# EAGLE design P20 Control Board V1 (EAGLE 9.5.0)

## Sheet 1 of 4
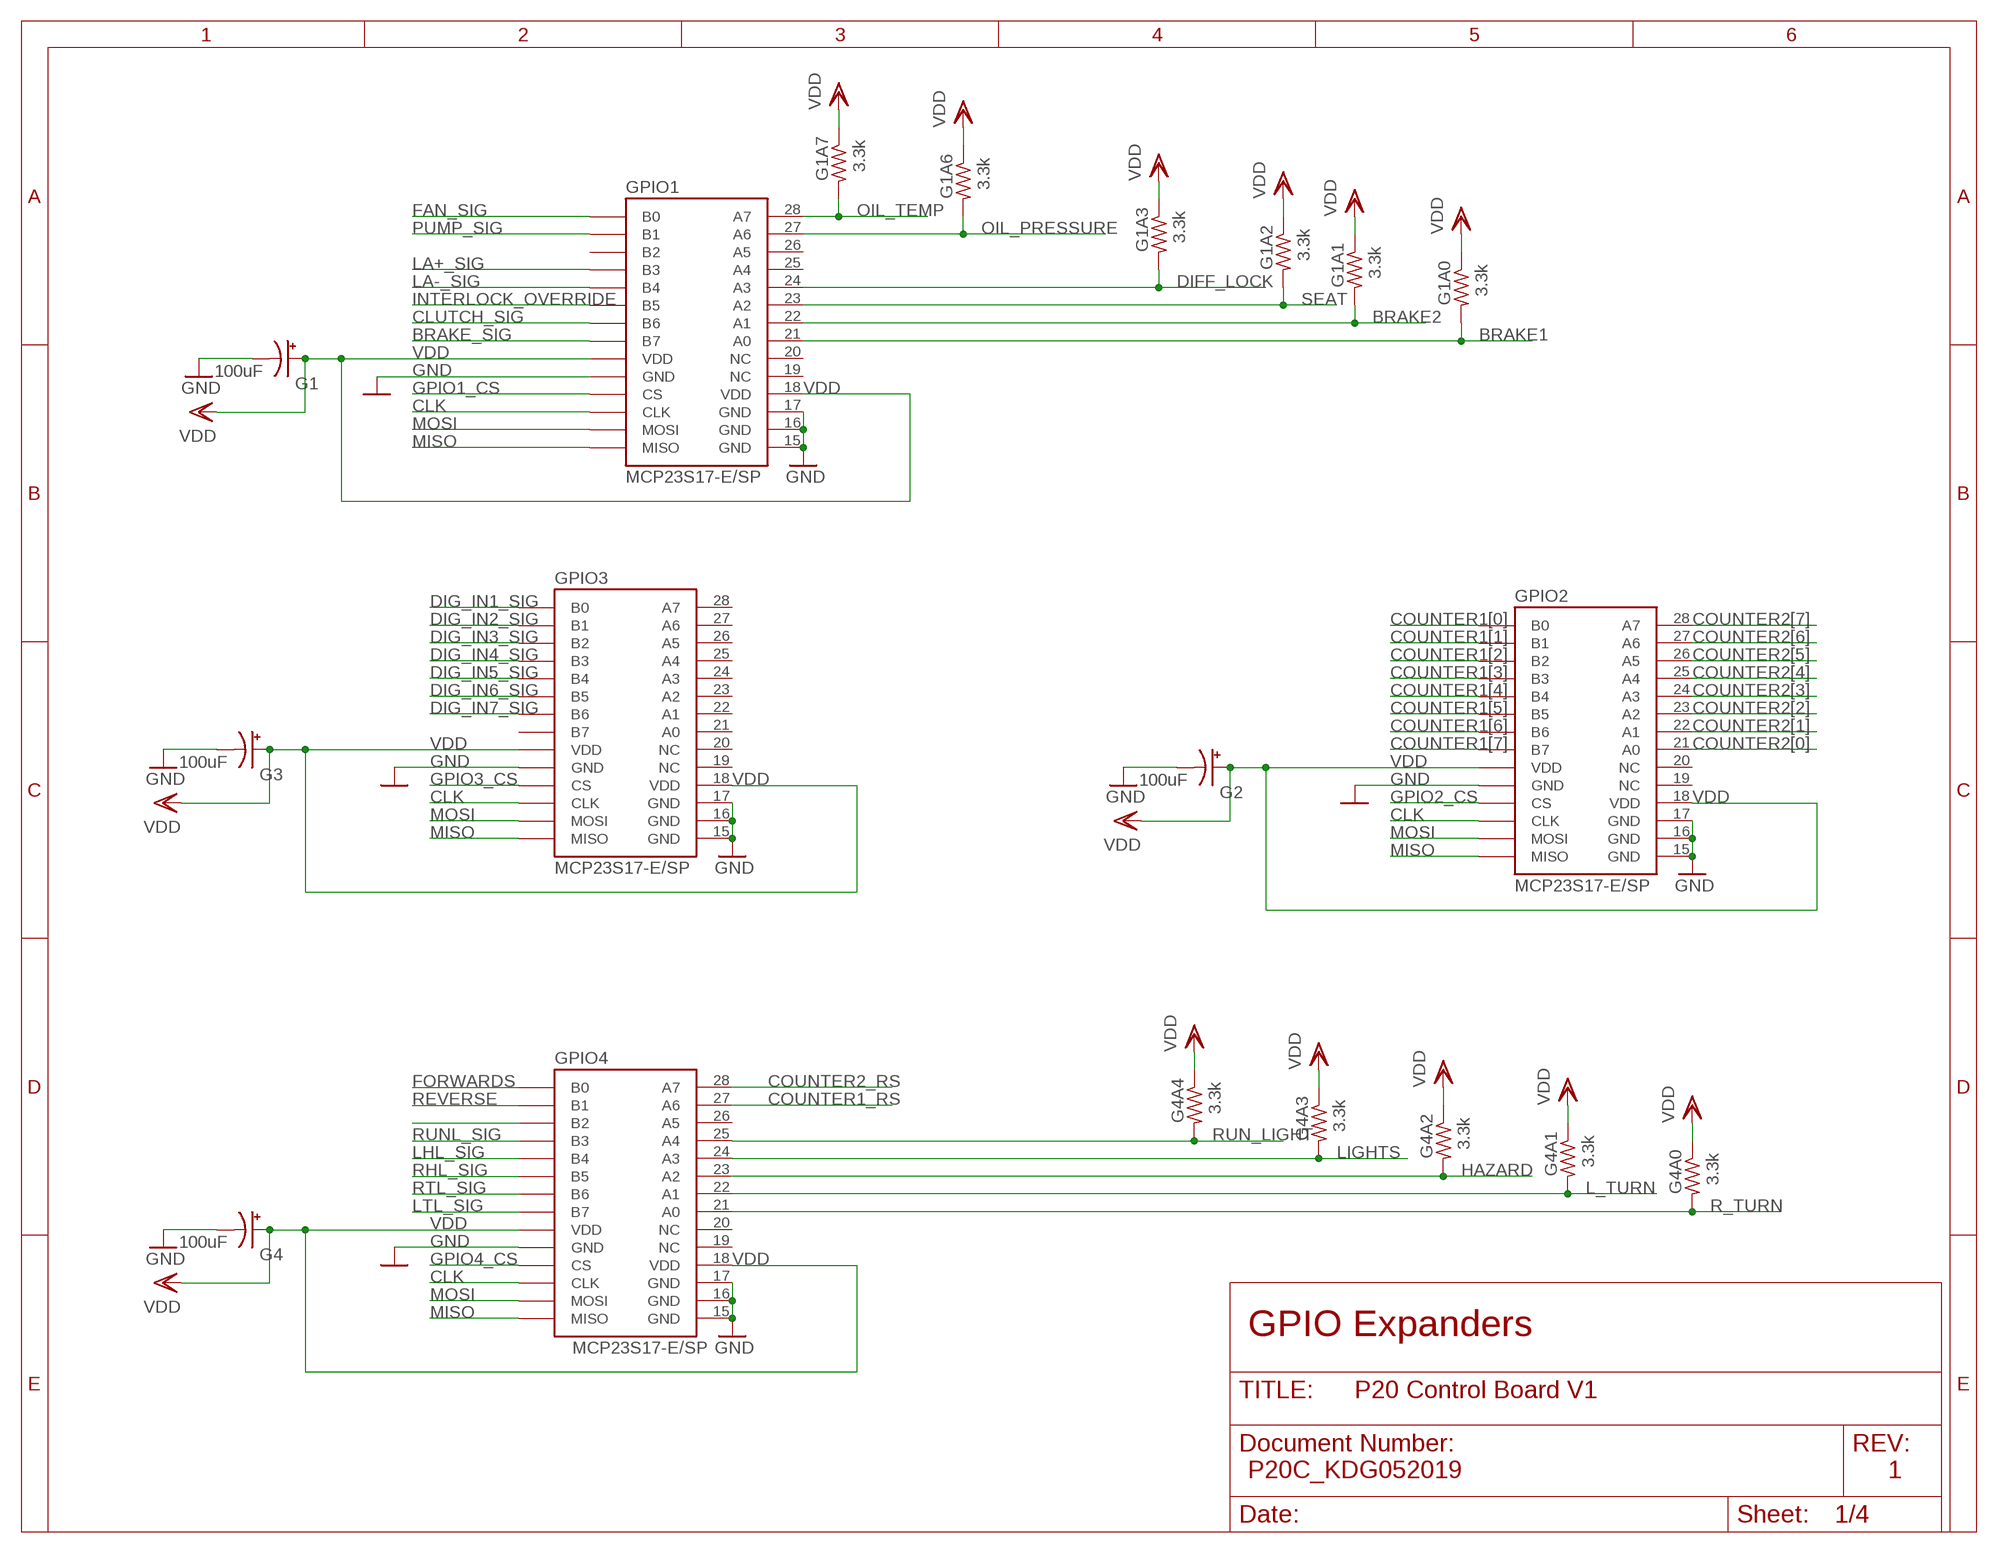
[diagram p0: schematic, sheet 1]

### Parts
G1  100uF  CPOL-USTAP5-80  [TAP5-80]
G1A0  3.3k  R-US_0207/10  [0207/10]
G1A1  3.3k  R-US_0207/10  [0207/10]
G1A2  3.3k  R-US_0207/10  [0207/10]
G1A3  3.3k  R-US_0207/10  [0207/10]
G1A6  3.3k  R-US_0207/10  [0207/10]
G1A7  3.3k  R-US_0207/10  [0207/10]
G2  100uF  CPOL-USTAP5-80  [TAP5-80]
G3  100uF  CPOL-USTAP5-80  [TAP5-80]
G4  100uF  CPOL-USTAP5-80  [TAP5-80]
G4A0  3.3k  R-US_0207/10  [0207/10]
G4A1  3.3k  R-US_0207/10  [0207/10]
G4A2  3.3k  R-US_0207/10  [0207/10]
G4A3  3.3k  R-US_0207/10  [0207/10]
G4A4  3.3k  R-US_0207/10  [0207/10]
GPIO1  MCP23S17-E/SP  [GPIO_XPDR]
GPIO2  MCP23S17-E/SP  [GPIO_XPDR]
GPIO3  MCP23S17-E/SP  [GPIO_XPDR]
GPIO4  MCP23S17-E/SP  [GPIO_XPDR]

### Nets
BRAKE1 [signals]: G1A0.2 GPIO1.21(A0) ; also sheet 2,4
BRAKE2 [signals]: G1A1.2 GPIO1.22(A1) ; also sheet 2,4
BRAKE_SIG [signals]: GPIO1.8(B7) ; also sheet 3
CLK [signals]: GPIO1.12(CLK) GPIO2.12(CLK) GPIO3.12(CLK) GPIO4.12(CLK) ; also sheet 2,4
CLUTCH_SIG [signals]: GPIO1.7(B6) ; also sheet 3
COUNTER1[0] [signals]: GPIO2.1(B0) ; also sheet 4
COUNTER1[1] [signals]: GPIO2.2(B1) ; also sheet 4
COUNTER1[2] [signals]: GPIO2.3(B2) ; also sheet 4
COUNTER1[3] [signals]: GPIO2.4(B3) ; also sheet 4
COUNTER1[4] [signals]: GPIO2.5(B4) ; also sheet 4
COUNTER1[5] [signals]: GPIO2.6(B5) ; also sheet 4
COUNTER1[6] [signals]: GPIO2.7(B6) ; also sheet 4
COUNTER1[7] [signals]: GPIO2.8(B7) ; also sheet 4
COUNTER1_RS [signals]: GPIO4.27(A6) ; also sheet 4
COUNTER2[0] [signals]: GPIO2.21(A0) ; also sheet 4
COUNTER2[1] [signals]: GPIO2.22(A1) ; also sheet 4
COUNTER2[2] [signals]: GPIO2.23(A2) ; also sheet 4
COUNTER2[3] [signals]: GPIO2.24(A3) ; also sheet 4
COUNTER2[4] [signals]: GPIO2.25(A4) ; also sheet 4
COUNTER2[5] [signals]: GPIO2.26(A5) ; also sheet 4
COUNTER2[6] [signals]: GPIO2.27(A6) ; also sheet 4
COUNTER2[7] [signals]: GPIO2.28(A7) ; also sheet 4
COUNTER2_RS [signals]: GPIO4.28(A7) ; also sheet 4
DIFF_LOCK [signals]: G1A3.2 GPIO1.24(A3) ; also sheet 2
DIG_IN1_SIG [signals]: GPIO3.1(B0) ; also sheet 3
DIG_IN2_SIG [signals]: GPIO3.2(B1) ; also sheet 3
DIG_IN3_SIG [signals]: GPIO3.3(B2) ; also sheet 3
DIG_IN4_SIG [signals]: GPIO3.4(B3) ; also sheet 3
DIG_IN5_SIG [signals]: GPIO3.5(B4) ; also sheet 3
DIG_IN6_SIG [signals]: GPIO3.6(B5) ; also sheet 3
DIG_IN7_SIG [signals]: GPIO3.7(B6) ; also sheet 3
FAN_SIG [signals]: GPIO1.1(B0) ; also sheet 3
FORWARDS [signals]: GPIO4.1(B0)
GND [ground]: G1.- G2.- G3.- G4.- GPIO1.10(GND) GPIO1.15(GND) GPIO1.16(GND) GPIO1.17(GND) GPIO2.10(GND) GPIO2.15(GND) GPIO2.16(GND) GPIO2.17(GND) GPIO3.10(GND) GPIO3.15(GND) GPIO3.16(GND) GPIO3.17(GND) GPIO4.10(GND) GPIO4.15(GND) GPIO4.16(GND) GPIO4.17(GND) ; also sheet 2,3,4
GPIO1_CS [signals]: GPIO1.11(CS) ; also sheet 2
GPIO2_CS [signals]: GPIO2.11(CS) ; also sheet 2
GPIO3_CS [signals]: GPIO3.11(CS) ; also sheet 2
GPIO4_CS [signals]: GPIO4.11(CS) ; also sheet 2
HAZARD [signals]: G4A2.2 GPIO4.23(A2) ; also sheet 2
INTERLOCK_OVERRIDE [signals]: GPIO1.6(B5) ; also sheet 4
L_TURN [signals]: G4A1.2 GPIO4.22(A1) ; also sheet 2
LA+_SIG [signals]: GPIO1.4(B3) ; also sheet 3
LA-_SIG [signals]: GPIO1.5(B4) ; also sheet 3
LHL_SIG [signals]: GPIO4.5(B4) ; also sheet 3
LIGHTS [signals]: G4A3.2 GPIO4.24(A3) ; also sheet 2
LTL_SIG [signals]: GPIO4.8(B7) ; also sheet 3
MISO [signals]: GPIO1.14(MISO) GPIO2.14(MISO) GPIO3.14(MISO) GPIO4.14(MISO) ; also sheet 2,4
MOSI [signals]: GPIO1.13(MOSI) GPIO2.13(MOSI) GPIO3.13(MOSI) GPIO4.13(MOSI) ; also sheet 2,4
N$25: GPIO4.3(B2)
OIL_PRESSURE [signals]: G1A6.2 GPIO1.27(A6) ; also sheet 2
OIL_TEMP [signals]: G1A7.2 GPIO1.28(A7) ; also sheet 2,4
PUMP_SIG [signals]: GPIO1.2(B1) ; also sheet 3
R_TURN [signals]: G4A0.2 GPIO4.21(A0) ; also sheet 2
REVERSE [signals]: GPIO4.2(B1)
RHL_SIG [signals]: GPIO4.6(B5) ; also sheet 3
RTL_SIG [signals]: GPIO4.7(B6) ; also sheet 3
RUN_LIGHT [signals]: G4A4.2 GPIO4.25(A4) ; also sheet 2
RUNL_SIG [signals]: GPIO4.4(B3) ; also sheet 3
SEAT [signals]: G1A2.2 GPIO1.23(A2) ; also sheet 2,4
VDD [VDD]: G1.+ G1A0.1 G1A1.1 G1A2.1 G1A3.1 G1A6.1 G1A7.1 G2.+ G3.+ G4.+ G4A0.1 G4A1.1 G4A2.1 G4A3.1 G4A4.1 GPIO1.9(VDD) GPIO1.18(VDD) GPIO2.9(VDD) GPIO2.18(VDD) GPIO3.9(VDD) GPIO3.18(VDD) GPIO4.9(VDD) GPIO4.18(VDD) ; also sheet 2,4
Unconnected: GPIO1.3(B2) GPIO1.19(NC) GPIO1.20(NC) GPIO1.25(A4) GPIO1.26(A5) GPIO2.19(NC) GPIO2.20(NC) GPIO3.8(B7) GPIO3.19(NC) GPIO3.20(NC) GPIO3.21(A0) GPIO3.22(A1) GPIO3.23(A2) GPIO3.24(A3) GPIO3.25(A4) GPIO3.26(A5) GPIO3.27(A6) GPIO3.28(A7) GPIO4.19(NC) GPIO4.20(NC) GPIO4.26(A5)

### Notes on the sheet
- GPIO Expanders
- P20C_KDG052019 | 1

## Sheet 2 of 4
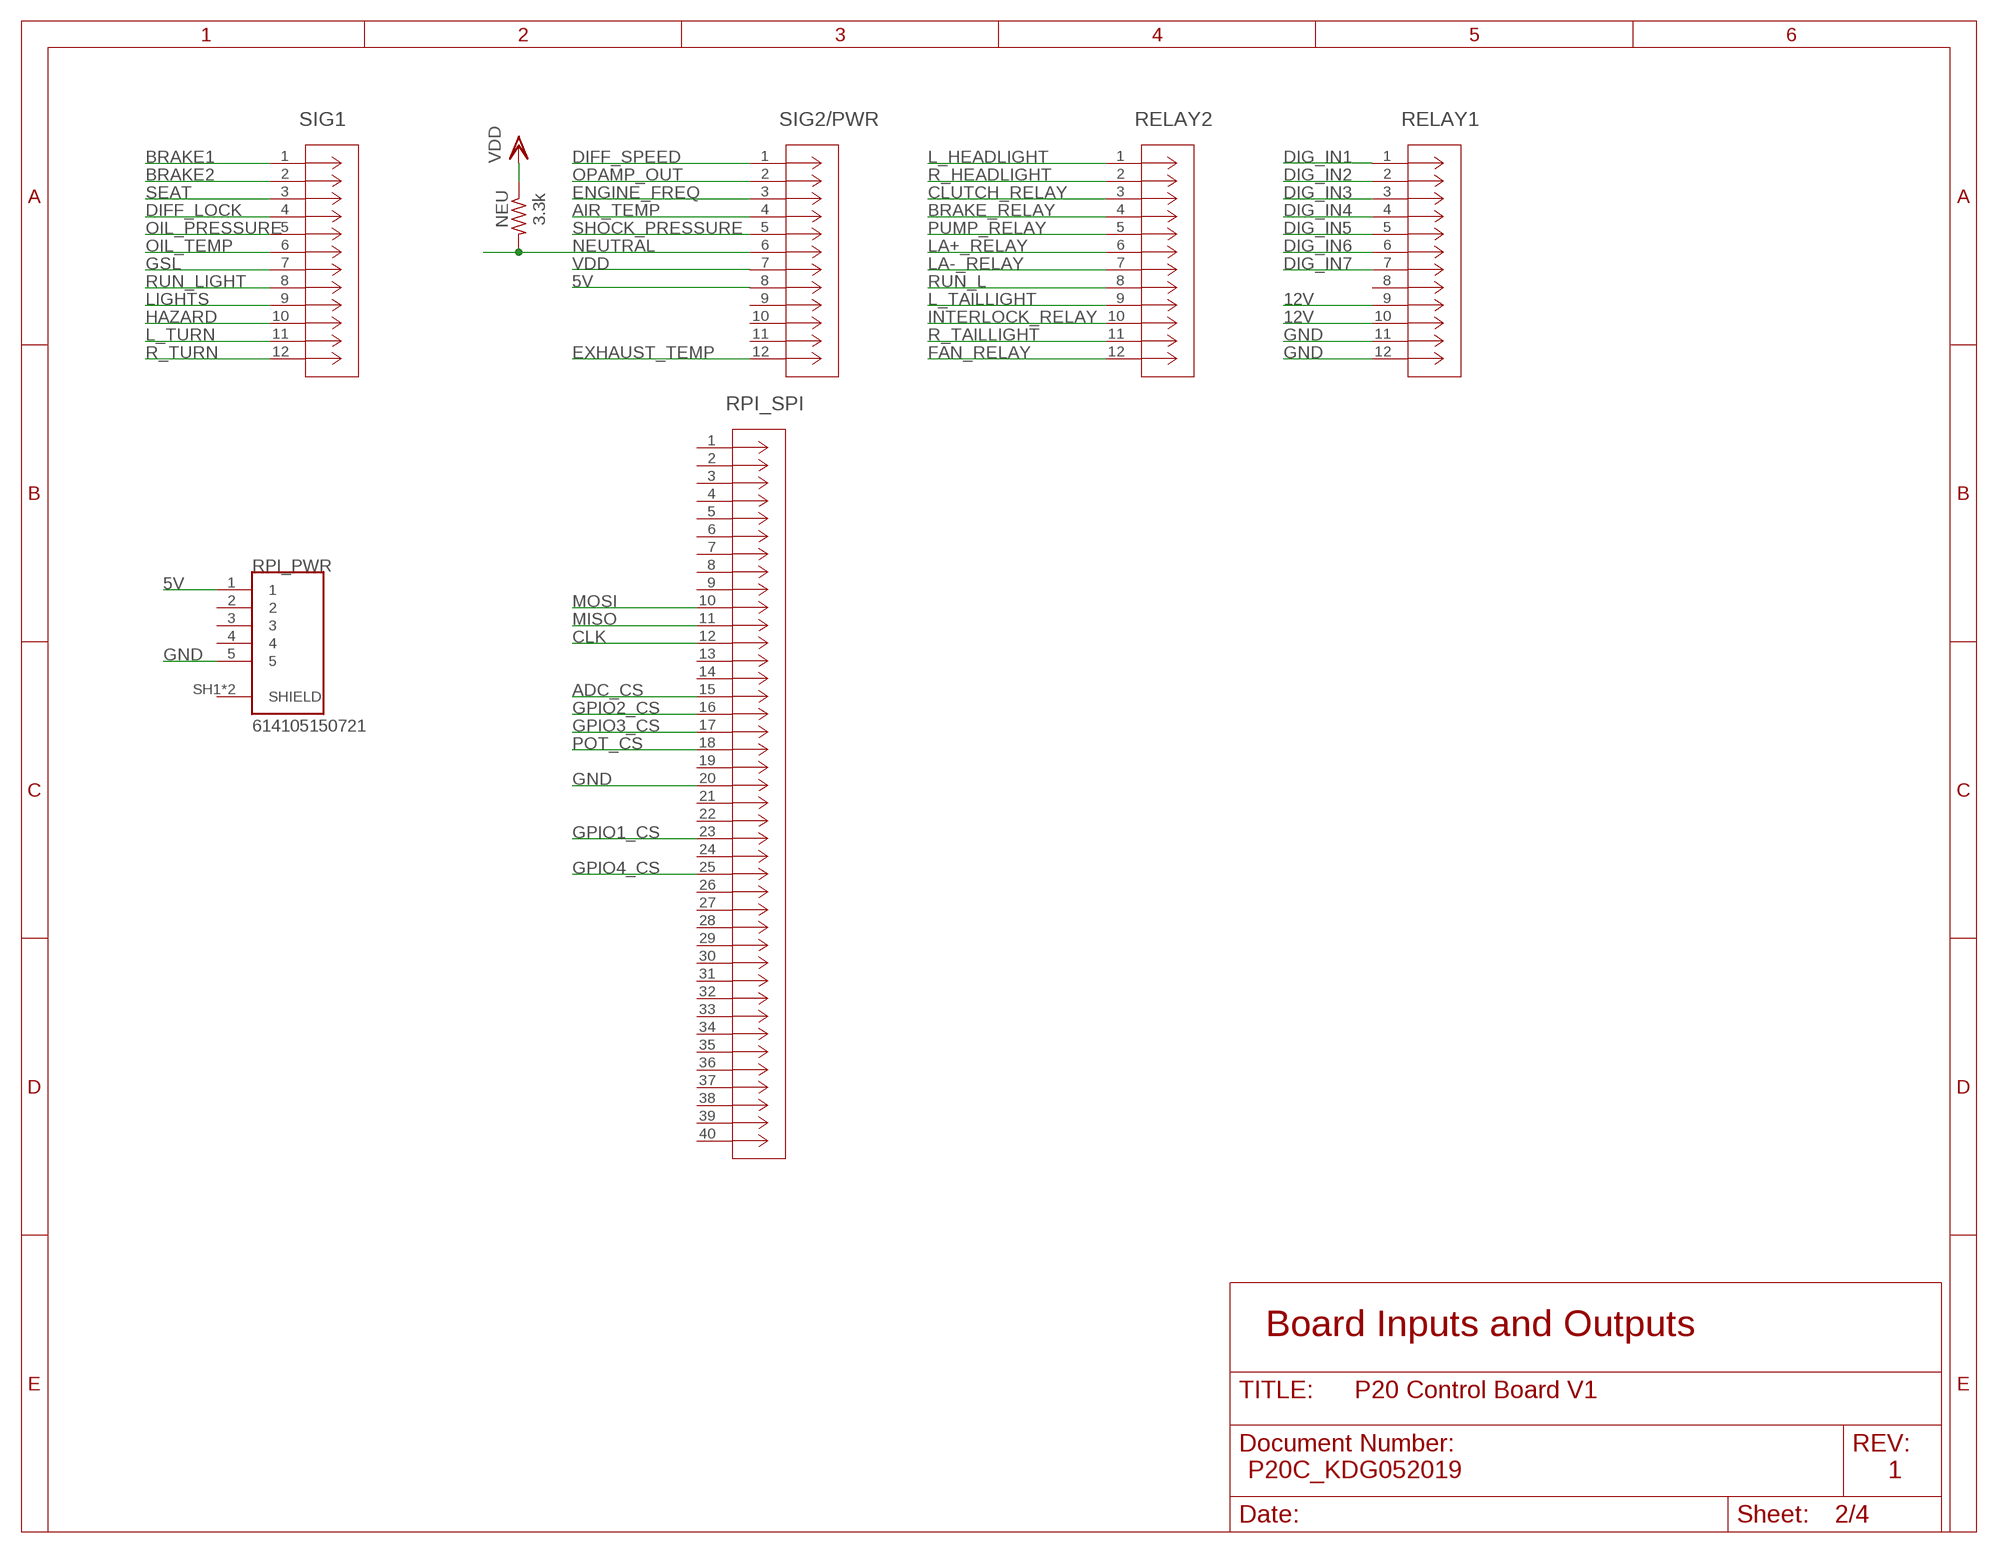
[diagram p1: schematic, sheet 2]

### Parts
NEU  3.3k  R-US_0207/10  [0207/10]
RELAY1  DTM13-12PA  [CONN12_DTM13-12PA]
RELAY2  DTM13-12PA  [CONN12_DTM13-12PA]
RPI_PWR  614105150721  [WURTH_614105150721]
RPI_SPI  1-746610-9  [CON40_P100X100-RIBBON]
SIG1  DTM13-12PA  [CONN12_DTM13-12PA]
SIG2/PWR  DTM13-12PA  [CONN12_DTM13-12PA]

### Nets
5V [5V]: RPI_PWR.1 SIG2/PWR.8 ; also sheet 4
12V [12V]: RELAY1.9 RELAY1.10 ; also sheet 4
ADC_CS [signals]: RPI_SPI.15 ; also sheet 4
AIR_TEMP [signals]: SIG2/PWR.4 ; also sheet 4
BRAKE1 [signals]: SIG1.1 ; also sheet 1,4
BRAKE2 [signals]: SIG1.2 ; also sheet 1,4
BRAKE_RELAY [signals]: RELAY2.4 ; also sheet 3
CLK [signals]: RPI_SPI.12 ; also sheet 1,4
CLUTCH_RELAY [signals]: RELAY2.3 ; also sheet 3
DIFF_LOCK [signals]: SIG1.4 ; also sheet 1
DIFF_SPEED [signals]: SIG2/PWR.1 ; also sheet 4
DIG_IN1 [signals]: RELAY1.1 ; also sheet 3
DIG_IN2 [signals]: RELAY1.2 ; also sheet 3
DIG_IN3 [signals]: RELAY1.3 ; also sheet 3
DIG_IN4 [signals]: RELAY1.4 ; also sheet 3
DIG_IN5 [signals]: RELAY1.5 ; also sheet 3
DIG_IN6 [signals]: RELAY1.6 ; also sheet 3
DIG_IN7 [signals]: RELAY1.7 ; also sheet 3
ENGINE_FREQ [signals]: SIG2/PWR.3 ; also sheet 4
EXHAUST_TEMP [signals]: SIG2/PWR.12 ; also sheet 4
FAN_RELAY [signals]: RELAY2.12 ; also sheet 3
GND [ground]: RELAY1.11 RELAY1.12 RPI_PWR.5 RPI_SPI.20 ; also sheet 1,3,4
GPIO1_CS [signals]: RPI_SPI.23 ; also sheet 1
GPIO2_CS [signals]: RPI_SPI.16 ; also sheet 1
GPIO3_CS [signals]: RPI_SPI.17 ; also sheet 1
GPIO4_CS [signals]: RPI_SPI.25 ; also sheet 1
GSL [signals]: SIG1.7 ; also sheet 4
HAZARD [signals]: SIG1.10 ; also sheet 1
INTERLOCK_RELAY [signals]: RELAY2.10 ; also sheet 3
L_HEADLIGHT [signals]: RELAY2.1 ; also sheet 3
L_TAILLIGHT [signals]: RELAY2.9 ; also sheet 3
L_TURN [signals]: SIG1.11 ; also sheet 1
LA+_RELAY [signals]: RELAY2.6 ; also sheet 3
LA-_RELAY [signals]: RELAY2.7 ; also sheet 3
LIGHTS [signals]: SIG1.9 ; also sheet 1
MISO [signals]: RPI_SPI.11 ; also sheet 1,4
MOSI [signals]: RPI_SPI.10 ; also sheet 1,4
NEUTRAL: NEU.2 SIG2/PWR.6 ; also sheet 4
OIL_PRESSURE [signals]: SIG1.5 ; also sheet 1
OIL_TEMP [signals]: SIG1.6 ; also sheet 1,4
OPAMP_OUT [signals]: SIG2/PWR.2 ; also sheet 4
POT_CS [signals]: RPI_SPI.18 ; also sheet 4
PUMP_RELAY [signals]: RELAY2.5 ; also sheet 3
R_HEADLIGHT [signals]: RELAY2.2 ; also sheet 3
R_TAILLIGHT [signals]: RELAY2.11 ; also sheet 3
R_TURN [signals]: SIG1.12 ; also sheet 1
RUN_L [signals]: RELAY2.8 ; also sheet 3
RUN_LIGHT [signals]: SIG1.8 ; also sheet 1
SEAT [signals]: SIG1.3 ; also sheet 1,4
SHOCK_PRESSURE [signals]: SIG2/PWR.5 ; also sheet 4
VDD [VDD]: NEU.1 SIG2/PWR.7 ; also sheet 1,4
Unconnected: RELAY1.8 RPI_PWR.2 RPI_PWR.3 RPI_PWR.4 RPI_PWR.SH1(SHIELD) RPI_PWR.SH2(SHIELD) RPI_SPI.1 RPI_SPI.2 RPI_SPI.3 RPI_SPI.4 RPI_SPI.5 RPI_SPI.6 RPI_SPI.7 RPI_SPI.8 RPI_SPI.9 RPI_SPI.13 RPI_SPI.14 RPI_SPI.19 RPI_SPI.21 RPI_SPI.22 RPI_SPI.24 RPI_SPI.26 RPI_SPI.27 RPI_SPI.28 RPI_SPI.29 RPI_SPI.30 RPI_SPI.31 RPI_SPI.32 RPI_SPI.33 RPI_SPI.34 RPI_SPI.35 RPI_SPI.36 RPI_SPI.37 RPI_SPI.38 RPI_SPI.39 RPI_SPI.40 SIG2/PWR.9 SIG2/PWR.10 SIG2/PWR.11

### Notes on the sheet
- Board Inputs and Outputs
- P20C_KDG052019 | 1

## Sheet 3 of 4
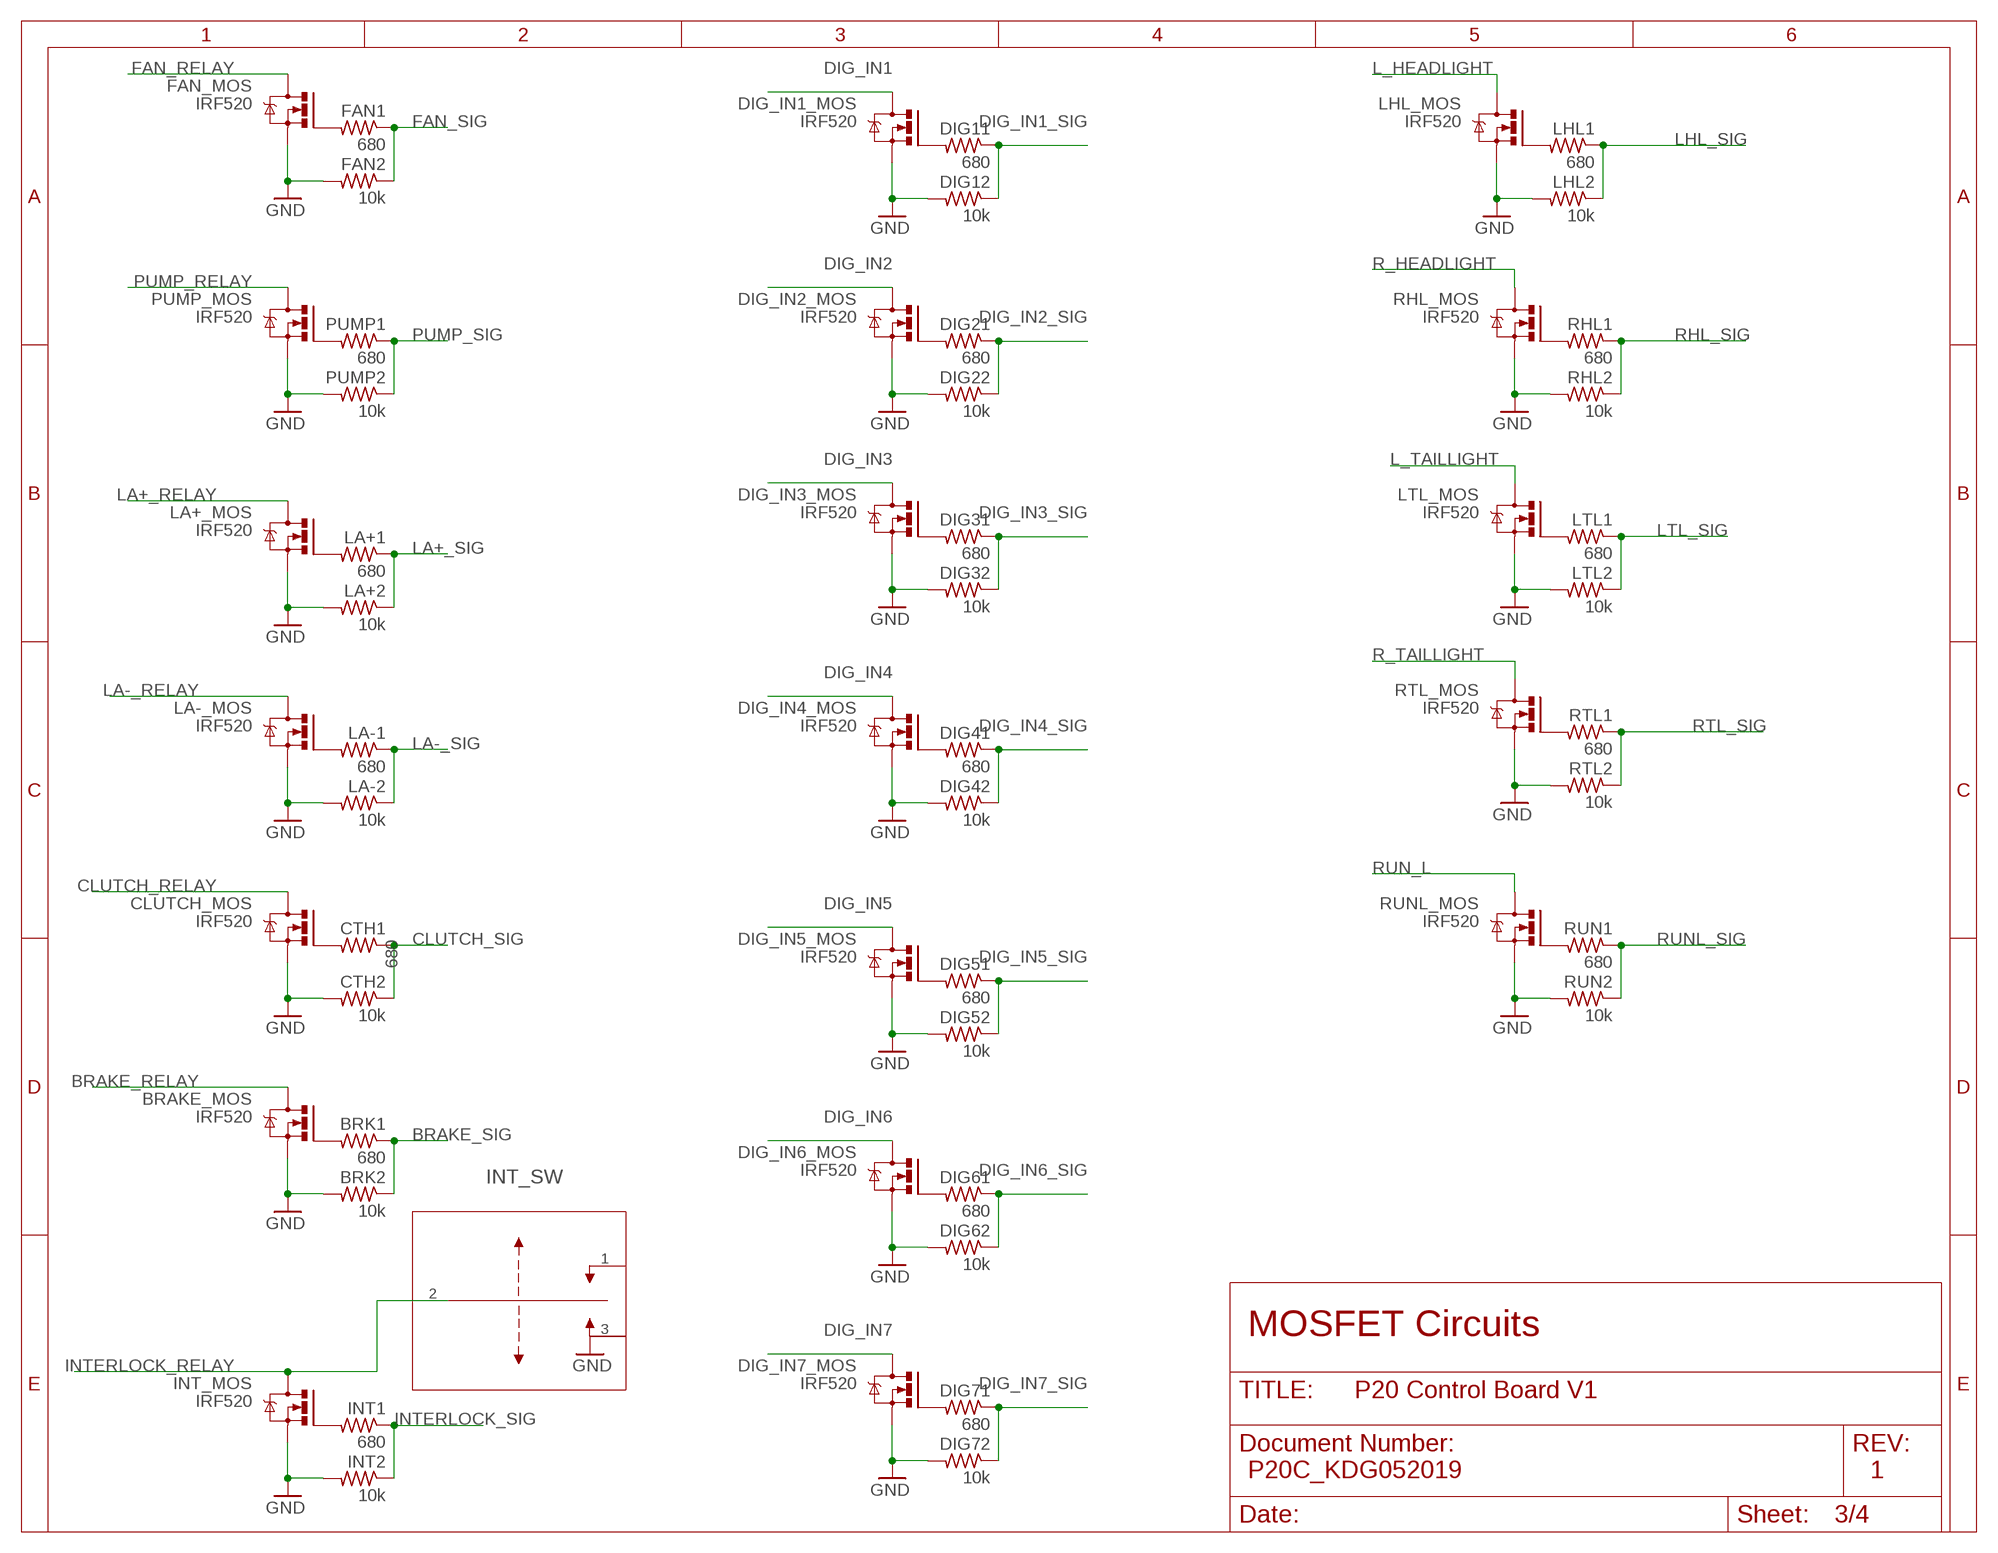
[diagram p2: schematic, sheet 3]

### Parts
BRAKE_MOS  IRF520  [TO220BV]
BRK1  680  R-US_0207/10  [0207/10]
BRK2  10k  R-US_0207/10  [0207/10]
CLUTCH_MOS  IRF520  [TO220BV]
CTH1  680  R-US_0207/10  [0207/10]
CTH2  10k  R-US_0207/10  [0207/10]
DIG11  680  R-US_0207/10  [0207/10]
DIG12  10k  R-US_0207/10  [0207/10]
DIG21  680  R-US_0207/10  [0207/10]
DIG22  10k  R-US_0207/10  [0207/10]
DIG31  680  R-US_0207/10  [0207/10]
DIG32  10k  R-US_0207/10  [0207/10]
DIG41  680  R-US_0207/10  [0207/10]
DIG42  10k  R-US_0207/10  [0207/10]
DIG51  680  R-US_0207/10  [0207/10]
DIG52  10k  R-US_0207/10  [0207/10]
DIG61  680  R-US_0207/10  [0207/10]
DIG62  10k  R-US_0207/10  [0207/10]
DIG71  680  R-US_0207/10  [0207/10]
DIG72  10k  R-US_0207/10  [0207/10]
DIG_IN1_MOS  IRF520  [TO220BV]
DIG_IN2_MOS  IRF520  [TO220BV]
DIG_IN3_MOS  IRF520  [TO220BV]
DIG_IN4_MOS  IRF520  [TO220BV]
DIG_IN5_MOS  IRF520  [TO220BV]
DIG_IN6_MOS  IRF520  [TO220BV]
DIG_IN7_MOS  IRF520  [TO220BV]
FAN1  680  R-US_0207/10  [0207/10]
FAN2  10k  R-US_0207/10  [0207/10]
FAN_MOS  IRF520  [TO220BV]
INT1  680  R-US_0207/10  [0207/10]
INT2  10k  R-US_0207/10  [0207/10]
INT_MOS  IRF520  [TO220BV]
INT_SW  1101M2S3CQE2  [1101M2S3CQE2]
LA+1  680  R-US_0207/10  [0207/10]
LA+2  10k  R-US_0207/10  [0207/10]
LA+_MOS  IRF520  [TO220BV]
LA-1  680  R-US_0207/10  [0207/10]
LA-2  10k  R-US_0207/10  [0207/10]
LA-_MOS  IRF520  [TO220BV]
LHL1  680  R-US_0207/10  [0207/10]
LHL2  10k  R-US_0207/10  [0207/10]
LHL_MOS  IRF520  [TO220BV]
LTL1  680  R-US_0207/10  [0207/10]
LTL2  10k  R-US_0207/10  [0207/10]
LTL_MOS  IRF520  [TO220BV]
PUMP1  680  R-US_0207/10  [0207/10]
PUMP2  10k  R-US_0207/10  [0207/10]
PUMP_MOS  IRF520  [TO220BV]
RHL1  680  R-US_0207/10  [0207/10]
RHL2  10k  R-US_0207/10  [0207/10]
RHL_MOS  IRF520  [TO220BV]
RTL1  680  R-US_0207/10  [0207/10]
RTL2  10k  R-US_0207/10  [0207/10]
RTL_MOS  IRF520  [TO220BV]
RUN1  680  R-US_0207/10  [0207/10]
RUN2  10k  R-US_0207/10  [0207/10]
RUNL_MOS  IRF520  [TO220BV]

### Nets
BRAKE_RELAY [signals]: BRAKE_MOS.D ; also sheet 2
BRAKE_SIG [signals]: BRK1.1 BRK2.1 ; also sheet 1
CLUTCH_RELAY [signals]: CLUTCH_MOS.D ; also sheet 2
CLUTCH_SIG [signals]: CTH1.1 CTH2.1 ; also sheet 1
DIG_IN1 [signals]: DIG_IN1_MOS.D ; also sheet 2
DIG_IN1_SIG [signals]: DIG11.1 DIG12.1 ; also sheet 1
DIG_IN2 [signals]: DIG_IN2_MOS.D ; also sheet 2
DIG_IN2_SIG [signals]: DIG21.1 DIG22.1 ; also sheet 1
DIG_IN3 [signals]: DIG_IN3_MOS.D ; also sheet 2
DIG_IN3_SIG [signals]: DIG31.1 DIG32.1 ; also sheet 1
DIG_IN4 [signals]: DIG_IN4_MOS.D ; also sheet 2
DIG_IN4_SIG [signals]: DIG41.1 DIG42.1 ; also sheet 1
DIG_IN5 [signals]: DIG_IN5_MOS.D ; also sheet 2
DIG_IN5_SIG [signals]: DIG51.1 DIG52.1 ; also sheet 1
DIG_IN6 [signals]: DIG_IN6_MOS.D ; also sheet 2
DIG_IN6_SIG [signals]: DIG61.1 DIG62.1 ; also sheet 1
DIG_IN7 [signals]: DIG_IN7_MOS.D ; also sheet 2
DIG_IN7_SIG [signals]: DIG71.1 DIG72.1 ; also sheet 1
FAN_RELAY [signals]: FAN_MOS.D ; also sheet 2
FAN_SIG [signals]: FAN1.1 FAN2.1 ; also sheet 1
GND [ground]: BRAKE_MOS.S BRK2.2 CLUTCH_MOS.S CTH2.2 DIG12.2 DIG22.2 DIG32.2 DIG42.2 DIG52.2 DIG62.2 DIG72.2 DIG_IN1_MOS.S DIG_IN2_MOS.S DIG_IN3_MOS.S DIG_IN4_MOS.S DIG_IN5_MOS.S DIG_IN6_MOS.S DIG_IN7_MOS.S FAN2.2 FAN_MOS.S INT2.2 INT_MOS.S INT_SW.3 LA+2.2 LA+_MOS.S LA-2.2 LA-_MOS.S LHL2.2 LHL_MOS.S LTL2.2 LTL_MOS.S PUMP2.2 PUMP_MOS.S RHL2.2 RHL_MOS.S RTL2.2 RTL_MOS.S RUN2.2 RUNL_MOS.S ; also sheet 1,2,4
INTERLOCK_RELAY [signals]: INT_MOS.D INT_SW.2 ; also sheet 2
INTERLOCK_SIG [signals]: INT1.1 INT2.1 ; also sheet 4
L_HEADLIGHT [signals]: LHL_MOS.D ; also sheet 2
L_TAILLIGHT [signals]: LTL_MOS.D ; also sheet 2
LA+_RELAY [signals]: LA+_MOS.D ; also sheet 2
LA+_SIG [signals]: LA+1.1 LA+2.1 ; also sheet 1
LA-_RELAY [signals]: LA-_MOS.D ; also sheet 2
LA-_SIG [signals]: LA-1.1 LA-2.1 ; also sheet 1
LHL_SIG [signals]: LHL1.1 LHL2.1 ; also sheet 1
LTL_SIG [signals]: LTL1.1 LTL2.1 ; also sheet 1
N$1: FAN1.2 FAN_MOS.G
N$2: PUMP1.2 PUMP_MOS.G
N$4: LA+1.2 LA+_MOS.G
N$5: LA-1.2 LA-_MOS.G
N$6: INT1.2 INT_MOS.G
N$7: DIG61.2 DIG_IN6_MOS.G
N$9: DIG71.2 DIG_IN7_MOS.G
N$11: DIG41.2 DIG_IN4_MOS.G
N$12: DIG51.2 DIG_IN5_MOS.G
N$14: DIG11.2 DIG_IN1_MOS.G
N$15: DIG21.2 DIG_IN2_MOS.G
N$17: DIG31.2 DIG_IN3_MOS.G
N$18: LHL1.2 LHL_MOS.G
N$19: RHL1.2 RHL_MOS.G
N$20: LTL1.2 LTL_MOS.G
N$21: RTL1.2 RTL_MOS.G
N$26: RUN1.2 RUNL_MOS.G
N$32: CLUTCH_MOS.G CTH1.2
N$33: BRAKE_MOS.G BRK1.2
PUMP_RELAY [signals]: PUMP_MOS.D ; also sheet 2
PUMP_SIG [signals]: PUMP1.1 PUMP2.1 ; also sheet 1
R_HEADLIGHT [signals]: RHL_MOS.D ; also sheet 2
R_TAILLIGHT [signals]: RTL_MOS.D ; also sheet 2
RHL_SIG [signals]: RHL1.1 RHL2.1 ; also sheet 1
RTL_SIG [signals]: RTL1.1 RTL2.1 ; also sheet 1
RUN_L [signals]: RUNL_MOS.D ; also sheet 2
RUNL_SIG [signals]: RUN1.1 RUN2.1 ; also sheet 1
Unconnected: INT_SW.1

### Notes on the sheet
- MOSFET Circuits
- P20C_KDG052019 | 1

## Sheet 4 of 4
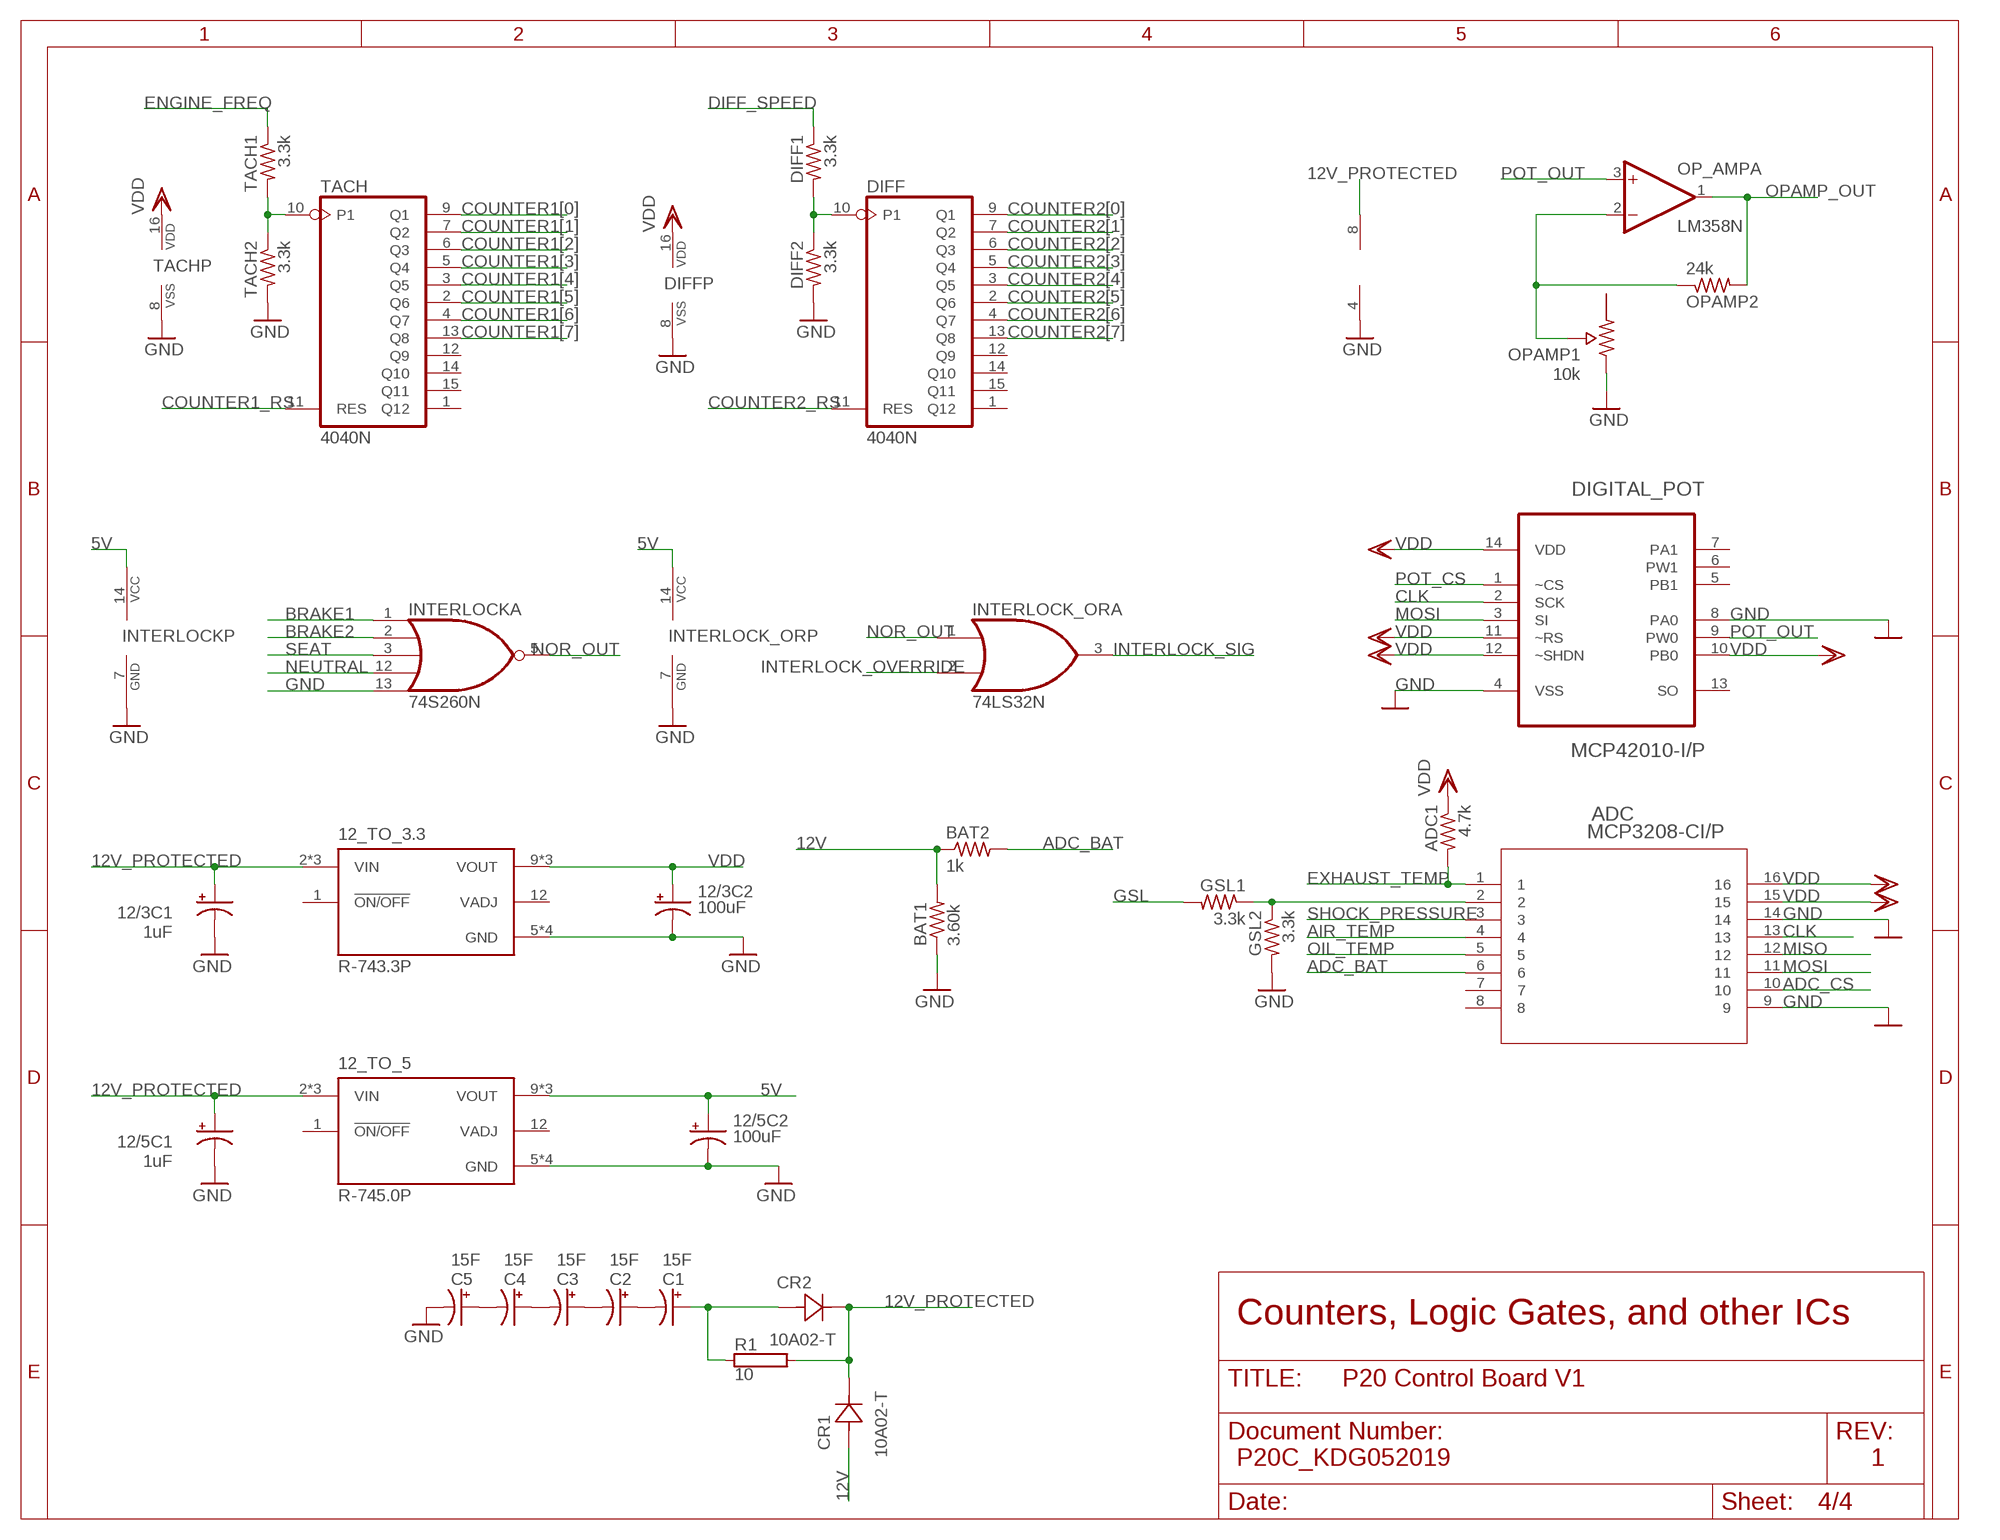
[diagram p3: schematic, sheet 4]

### Parts
12/3C1  1uF  CPOL-USTAP5-80  [TAP5-80]
12/3C2  100uF  CPOL-USTAP5-80  [TAP5-80]
12/5C1  1uF  CPOL-USTAP5-80  [TAP5-80]
12/5C2  100uF  CPOL-USTAP5-80  [TAP5-80]
12_TO_3.3  R-743.3P  [CONV_R-743.3P]
12_TO_5  R-745.0P  [CONV_R-745.0P]
ADC  MCP3208-CI/P  [PDIP16_300MC]
ADC1  4.7k  R-US_0207/10  [0207/10]
BAT1  3.60k  R-US_0207/10  [0207/10]
BAT2  1k  R-US_0207/10  [0207/10]
C1  15F  CPOL-USB45181D  [B45181D]
C2  15F  CPOL-USB45181D  [B45181D]
C3  15F  CPOL-USB45181D  [B45181D]
C4  15F  CPOL-USB45181D  [B45181D]
C5  15F  CPOL-USB45181D  [B45181D]
CR1  10A02-T  [R-6]
CR2  10A02-T  [R-6]
DIFF  4040N  [DIL16]
DIFF1  3.3k  R-US_0207/10  [0207/10]
DIFF2  3.3k  R-US_0207/10  [0207/10]
DIGITAL_POT  MCP42010-I/P  [DIP254P762X432-14]
GSL1  3.3k  R-US_0207/10  [0207/10]
GSL2  3.3k  R-US_0207/10  [0207/10]
INTERLOCK  74S260N  [DIL14]
INTERLOCK_OR  74LS32N  [DIL14]
OP_AMP  LM358N  [DIL08]
OPAMP1  10k  3386F-1-103TLF  [POT_3386F]
OPAMP2  24k  R-US_0207/10  [0207/10]
R1  10  RMG100-V  [TO-247-2V]
TACH  4040N  [DIL16]
TACH1  3.3k  R-US_0207/10  [0207/10]
TACH2  3.3k  R-US_0207/10  [0207/10]

### Nets
5V [5V]: 12/5C2.+ 12_TO_5.9(VOUT) 12_TO_5.10(VOUT) 12_TO_5.11(VOUT) INTERLOCK.14(P:VCC) INTERLOCK_OR.14(P:VCC) ; also sheet 2
12V [12V]: BAT1.2 BAT2.1 CR1.2 ; also sheet 2
12V_PROTECTED [12V]: 12/3C1.+ 12/5C1.+ 12_TO_3.3.2(VIN) 12_TO_3.3.3(VIN) 12_TO_3.3.4(VIN) 12_TO_5.2(VIN) 12_TO_5.3(VIN) 12_TO_5.4(VIN) CR1.1 CR2.1 OP_AMP.8(P:V+) R1.2
ADC_BAT [signals]: ADC.6 BAT2.2
ADC_CS [signals]: ADC.10 ; also sheet 2
AIR_TEMP [signals]: ADC.4 ; also sheet 2
BRAKE1 [signals]: INTERLOCK.1(A:I0) ; also sheet 1,2
BRAKE2 [signals]: INTERLOCK.2(A:I1) ; also sheet 1,2
CLK [signals]: ADC.13 DIGITAL_POT.2(SCK) ; also sheet 1,2
COUNTER1[0] [signals]: TACH.9(Q1) ; also sheet 1
COUNTER1[1] [signals]: TACH.7(Q2) ; also sheet 1
COUNTER1[2] [signals]: TACH.6(Q3) ; also sheet 1
COUNTER1[3] [signals]: TACH.5(Q4) ; also sheet 1
COUNTER1[4] [signals]: TACH.3(Q5) ; also sheet 1
COUNTER1[5] [signals]: TACH.2(Q6) ; also sheet 1
COUNTER1[6] [signals]: TACH.4(Q7) ; also sheet 1
COUNTER1[7] [signals]: TACH.13(Q8) ; also sheet 1
COUNTER1_RS [signals]: TACH.11(RES) ; also sheet 1
COUNTER2[0] [signals]: DIFF.9(Q1) ; also sheet 1
COUNTER2[1] [signals]: DIFF.7(Q2) ; also sheet 1
COUNTER2[2] [signals]: DIFF.6(Q3) ; also sheet 1
COUNTER2[3] [signals]: DIFF.5(Q4) ; also sheet 1
COUNTER2[4] [signals]: DIFF.3(Q5) ; also sheet 1
COUNTER2[5] [signals]: DIFF.2(Q6) ; also sheet 1
COUNTER2[6] [signals]: DIFF.4(Q7) ; also sheet 1
COUNTER2[7] [signals]: DIFF.13(Q8) ; also sheet 1
COUNTER2_RS [signals]: DIFF.11(RES) ; also sheet 1
DIFF_SPEED [signals]: DIFF1.1 ; also sheet 2
ENGINE_FREQ [signals]: TACH1.1 ; also sheet 2
EXHAUST_TEMP [signals]: ADC1.2 ADC.1 ; also sheet 2
GND [ground]: 12/3C1.- 12/3C2.- 12/5C1.- 12/5C2.- 12_TO_3.3.5(GND) 12_TO_3.3.6(GND) 12_TO_3.3.7(GND) 12_TO_3.3.8(GND) 12_TO_5.5(GND) 12_TO_5.6(GND) 12_TO_5.7(GND) 12_TO_5.8(GND) ADC.9 ADC.14 BAT1.1 C5.- DIFF2.2 DIFF.8(VSS) DIGITAL_POT.4(VSS) DIGITAL_POT.8(PA0) GSL2.2 INTERLOCK.7(P:GND) INTERLOCK.13(A:I4) INTERLOCK_OR.7(P:GND) OP_AMP.4(P:V-) OPAMP1.1 TACH2.2 TACH.8(VSS) ; also sheet 1,2,3
GSL [signals]: GSL1.2 ; also sheet 2
INTERLOCK_OVERRIDE [signals]: INTERLOCK_OR.2(A:I1) ; also sheet 1
INTERLOCK_SIG [signals]: INTERLOCK_OR.3(A:O) ; also sheet 3
MISO [signals]: ADC.12 ; also sheet 1,2
MOSI [signals]: ADC.11 DIGITAL_POT.3(SI) ; also sheet 1,2
N$8: OP_AMP.2(A:-IN) OPAMP1.2 OPAMP2.1
N$10: ADC.2 GSL1.1 GSL2.1
N$13: TACH1.2 TACH2.1 TACH.10(P1)
N$16: DIFF1.2 DIFF2.1 DIFF.10(P1)
N$22: C1.- C2.+
N$24: C1.+ CR2.2 R1.1
N$31: C2.- C3.+
N$34: C3.- C4.+
N$35: C4.- C5.+
NEUTRAL: INTERLOCK.12(A:I3) ; also sheet 2
NOR_OUT [signals]: INTERLOCK.5(A:O) INTERLOCK_OR.1(A:I0)
OIL_TEMP [signals]: ADC.5 ; also sheet 1,2
OPAMP_OUT [signals]: OP_AMP.1(A:OUT) OPAMP2.2 ; also sheet 2
POT_CS [signals]: DIGITAL_POT.1(~CS) ; also sheet 2
POT_OUT [signals]: DIGITAL_POT.9(PW0) OP_AMP.3(A:+IN)
SEAT [signals]: INTERLOCK.3(A:I2) ; also sheet 1,2
SHOCK_PRESSURE [signals]: ADC.3 ; also sheet 2
VDD [VDD]: 12/3C2.+ 12_TO_3.3.9(VOUT) 12_TO_3.3.10(VOUT) 12_TO_3.3.11(VOUT) ADC1.1 ADC.15 ADC.16 DIFF.16(VDD) DIGITAL_POT.10(PB0) DIGITAL_POT.11(~RS) DIGITAL_POT.12(~SHDN) DIGITAL_POT.14(VDD) TACH.16(VDD) ; also sheet 1,2
Unconnected: 12_TO_3.3.1(!ON/OFF) 12_TO_3.3.12(VADJ) 12_TO_5.1(!ON/OFF) 12_TO_5.12(VADJ) ADC.7 ADC.8 DIFF.1(Q12) DIFF.12(Q9) DIFF.14(Q10) DIFF.15(Q11) DIGITAL_POT.5(PB1) DIGITAL_POT.6(PW1) DIGITAL_POT.7(PA1) DIGITAL_POT.13(SO) INTERLOCK.4(B:I0) INTERLOCK.6(B:O) INTERLOCK.8(B:I1) INTERLOCK.9(B:I2) INTERLOCK.10(B:I3) INTERLOCK.11(B:I4) INTERLOCK_OR.4(B:I0) INTERLOCK_OR.5(B:I1) INTERLOCK_OR.6(B:O) INTERLOCK_OR.8(C:O) INTERLOCK_OR.9(C:I0) INTERLOCK_OR.10(C:I1) INTERLOCK_OR.11(D:O) INTERLOCK_OR.12(D:I0) INTERLOCK_OR.13(D:I1) OP_AMP.5(B:+IN) OP_AMP.6(B:-IN) OP_AMP.7(B:OUT) OPAMP1.3 TACH.1(Q12) TACH.12(Q9) TACH.14(Q10) TACH.15(Q11)

### Notes on the sheet
- Counters, Logic Gates, and other ICs
- P20C_KDG052019 | 1

## Library data of the parts
12/3C1 12/3C2 12/5C1 12/5C2 C1-C5 G1-G4 = rcl:CPOL-US: POLARIZED CAPACITOR, American symbol; SPICEPREFIX: C
12_TO_3.3 = UMATT:R-743.3P: 2,3,4 Amp SIP12 Vertical & Horizontal Single Output; AVAILABILITY: Unavailable; DESCRIPTION: DC/DC converter _print_ RECOM 3.3 Vdc 4 A 13 W No. of outputs: 1 x; MF: Recom Power; MP: R-743.3P; PACKAGE: SIP-12 Recom Power; PRICE: None
12_TO_5 = UMATT:R-745.0P: 2,3,4 Amp SIP12 Vertical & Horizontal Single Output; AVAILABILITY: Unavailable; DESCRIPTION: DC-DC Converter; Innoline, Non-Insolated; 4 Amp; 5.0V; Input Range 6.5-28V; MF: Recom Power; MP: R-745.0P; PACKAGE: SIP-12 Recom Power; PRICE: None
ADC = UMATT:MCP3208-CI/P; MANUFACTURER_PART_NUMBER: MCP3208CIP; VENDOR: Microchip
ADC1 BAT1 BAT2 BRK1 BRK2 CTH1 CTH2 DIFF1 DIFF2 DIG11 DIG12 DIG21 DIG22 DIG31 DIG32 DIG41 DIG42 DIG51 DIG52 DIG61 DIG62 DIG71 DIG72 FAN1 FAN2 G1A0 G1A1-G1A3 G1A6 G1A7 G4A0 G4A1-G4A4 GSL1 GSL2 INT1 INT2 LA+1 LA+2 LA-1 LA-2 LHL1 LHL2 LTL1 LTL2 NEU OPAMP2 PUMP1 PUMP2 RHL1 RHL2 RTL1 RTL2 RUN1 RUN2 TACH1 TACH2 = rcl:R-US_: RESISTOR, American symbol; SPICEPREFIX: R
BRAKE_MOS CLUTCH_MOS DIG_IN1_MOS DIG_IN2_MOS DIG_IN3_MOS DIG_IN4_MOS DIG_IN5_MOS DIG_IN6_MOS DIG_IN7_MOS FAN_MOS INT_MOS LA+_MOS LA-_MOS LHL_MOS LTL_MOS PUMP_MOS RHL_MOS RTL_MOS RUNL_MOS = transistor-power:IRF520: HEXFET Power MOSFET
CR1 CR2 = UMATT:10A02-T; BUILT_BY: EMA_UL_Team; MANUFACTURER_PART_NUMBER: 10A02-T; VENDOR: Diodes Inc
DIFF TACH = 40xx:4040: 12-stage binary/ripple COUNTER
DIGITAL_POT = MCP42010-I_P:MCP42010-I/P: Digital Potentiometer; AVAILABILITY: Unavailable; DESCRIPTION: MCP42 Series Dual 8-Bit 256 Step SPI 10 kOhm Non Volatile Digital POT-PDIP-14; MF: Microchip; MP: MCP42010-I/P; PACKAGE: DIP-14 Microchip; PRICE: None
GPIO1-GPIO4 = UMATT:MCP23S17-E/SP: GPIO Expander for Penelope 19; MP: MCP23S17-E/SP
INT_SW = UMATT:1101M2S3CQE2; BUILT_BY: EMA_UL_Team; MANUFACTURER_PART_NUMBER: 1101M2S3CQE2; VENDOR: C&K
INTERLOCK = 74xx-us:74*260: Dual 5-input positive NOR gate
INTERLOCK_OR = 74xx-us:74*32: Quad 2-input OR gate
OP_AMP = linear:LM358: OP AMP also LM158; LM258; LM2904 Source: http://cache.national.com/ds/LM/LM158.pdf
OPAMP1 = UMATT:3386F-1-103TLF; BUILT_BY: EMA_UL_Team; MANUFACTURER_PART_NUMBER: 3386F-1-103TLF; VENDOR: Bourns Electronics
R1 = resistor-power:RMG100: TO-247 Power Resistor - RMG 100 Series Source: www.token.com.tw .. power-resistor-rmg100pdf; OC_FARNELL: unknown; OC_NEWARK: unknown
RELAY1 RELAY2 SIG1 SIG2/PWR = UMATT:DTM13-12PA; MANUFACTURER_PART_NUMBER: DTM1312PA; VENDOR: TE Connectivity
RPI_PWR = UMATT:614105150721: Vertical Through Hole; sion 2.0 Micro USB Connector Socket; DESCRIPTION: Vertical Through Hole; sion 2.0 Micro USB Connector Socket; DIGI-KEY_PART_NUMBER: 732-5958-1-ND; DIGI-KEY_PURCHASE_URL: https://www.digikey.ca/product-detail/en/w-rth-elektronik/614105150721/732-5958-1-ND/5047553?utm_source=snapeda&utm_medium=aggregator&utm_campaign=symbol; MF: Wurth Electronics; MP: 614105150721; PACKAGE: None
RPI_SPI = UMATT:1-746610-9; BUILT_BY: EMA_UL_Team; MANUFACTURER_PART_NUMBER: 1-746610-9; VENDOR: TE Connectivity

## Net classes
0 default: width 0.254 mm
1 signals: width 0.254 mm

## Board
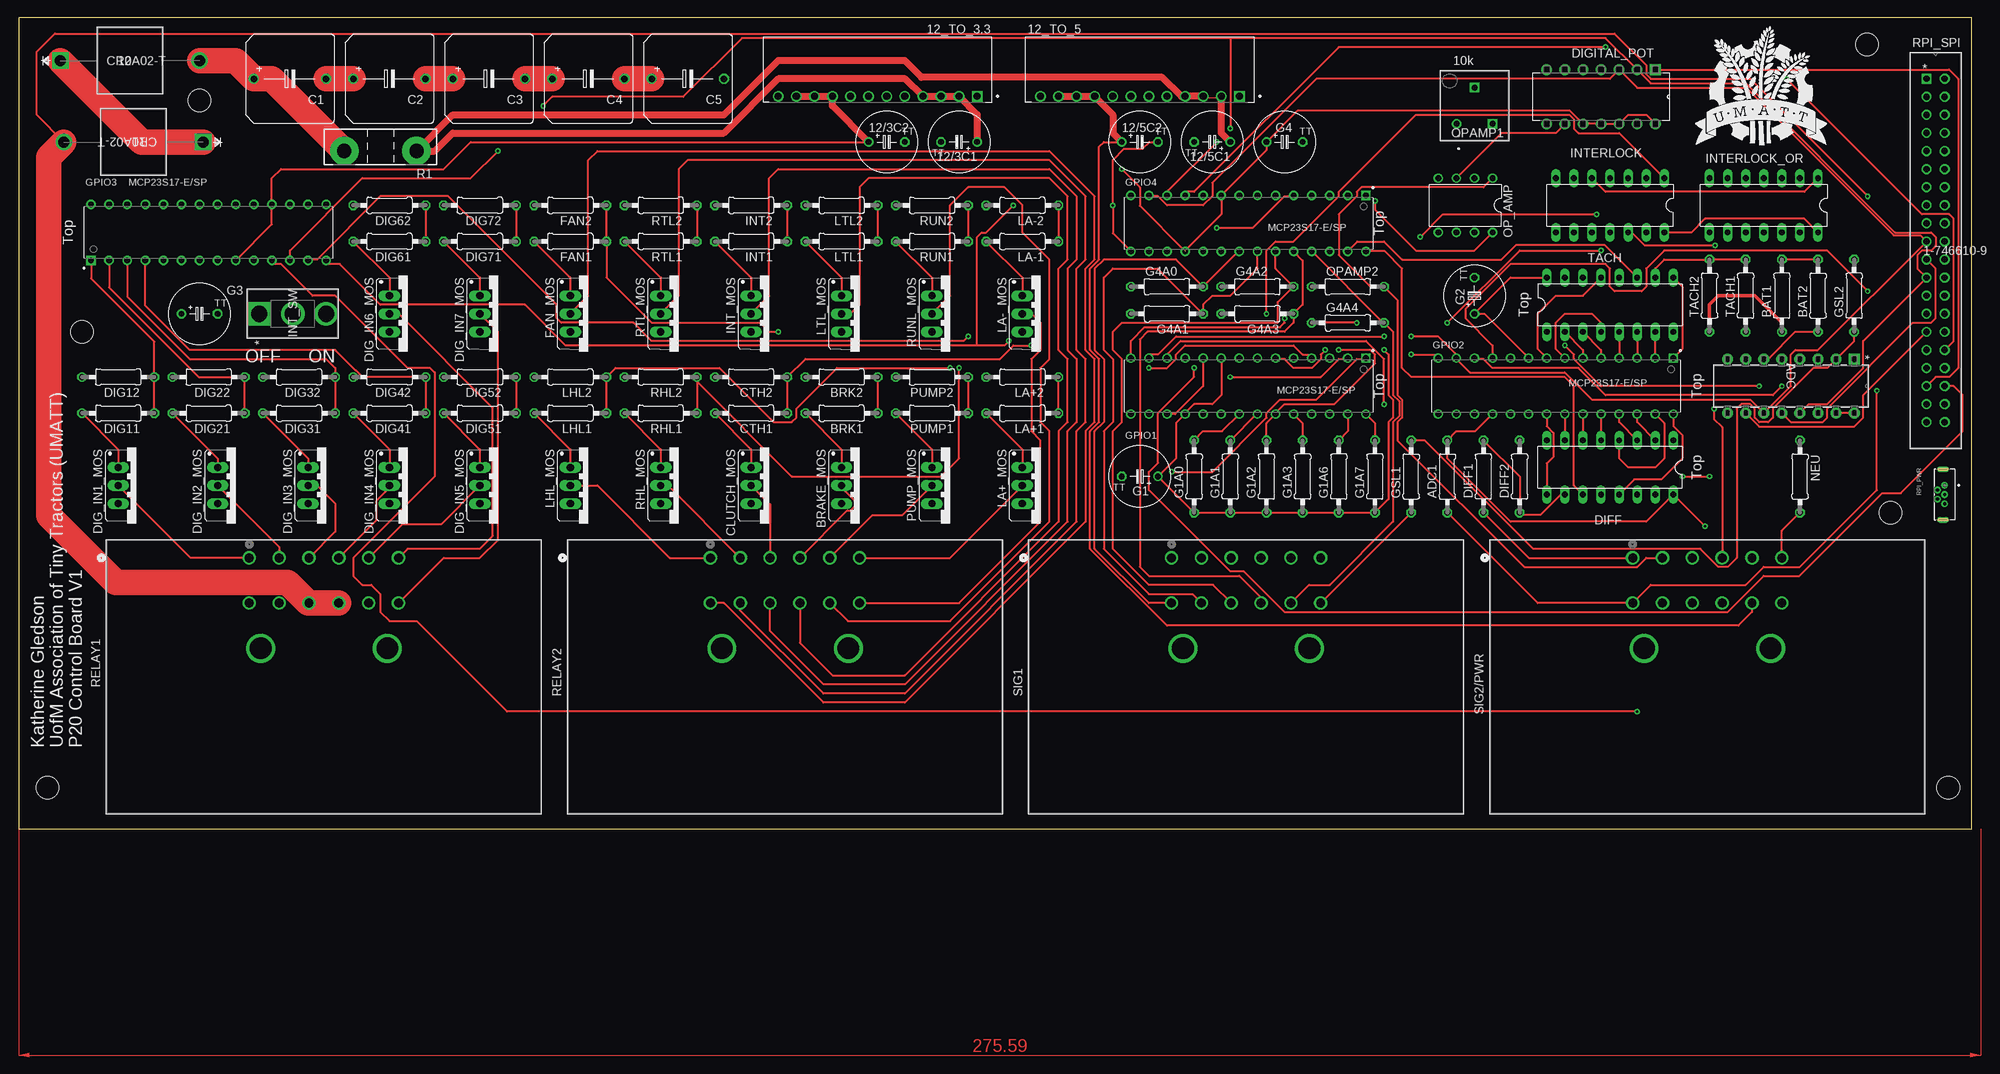
[diagram p4: board, top side]
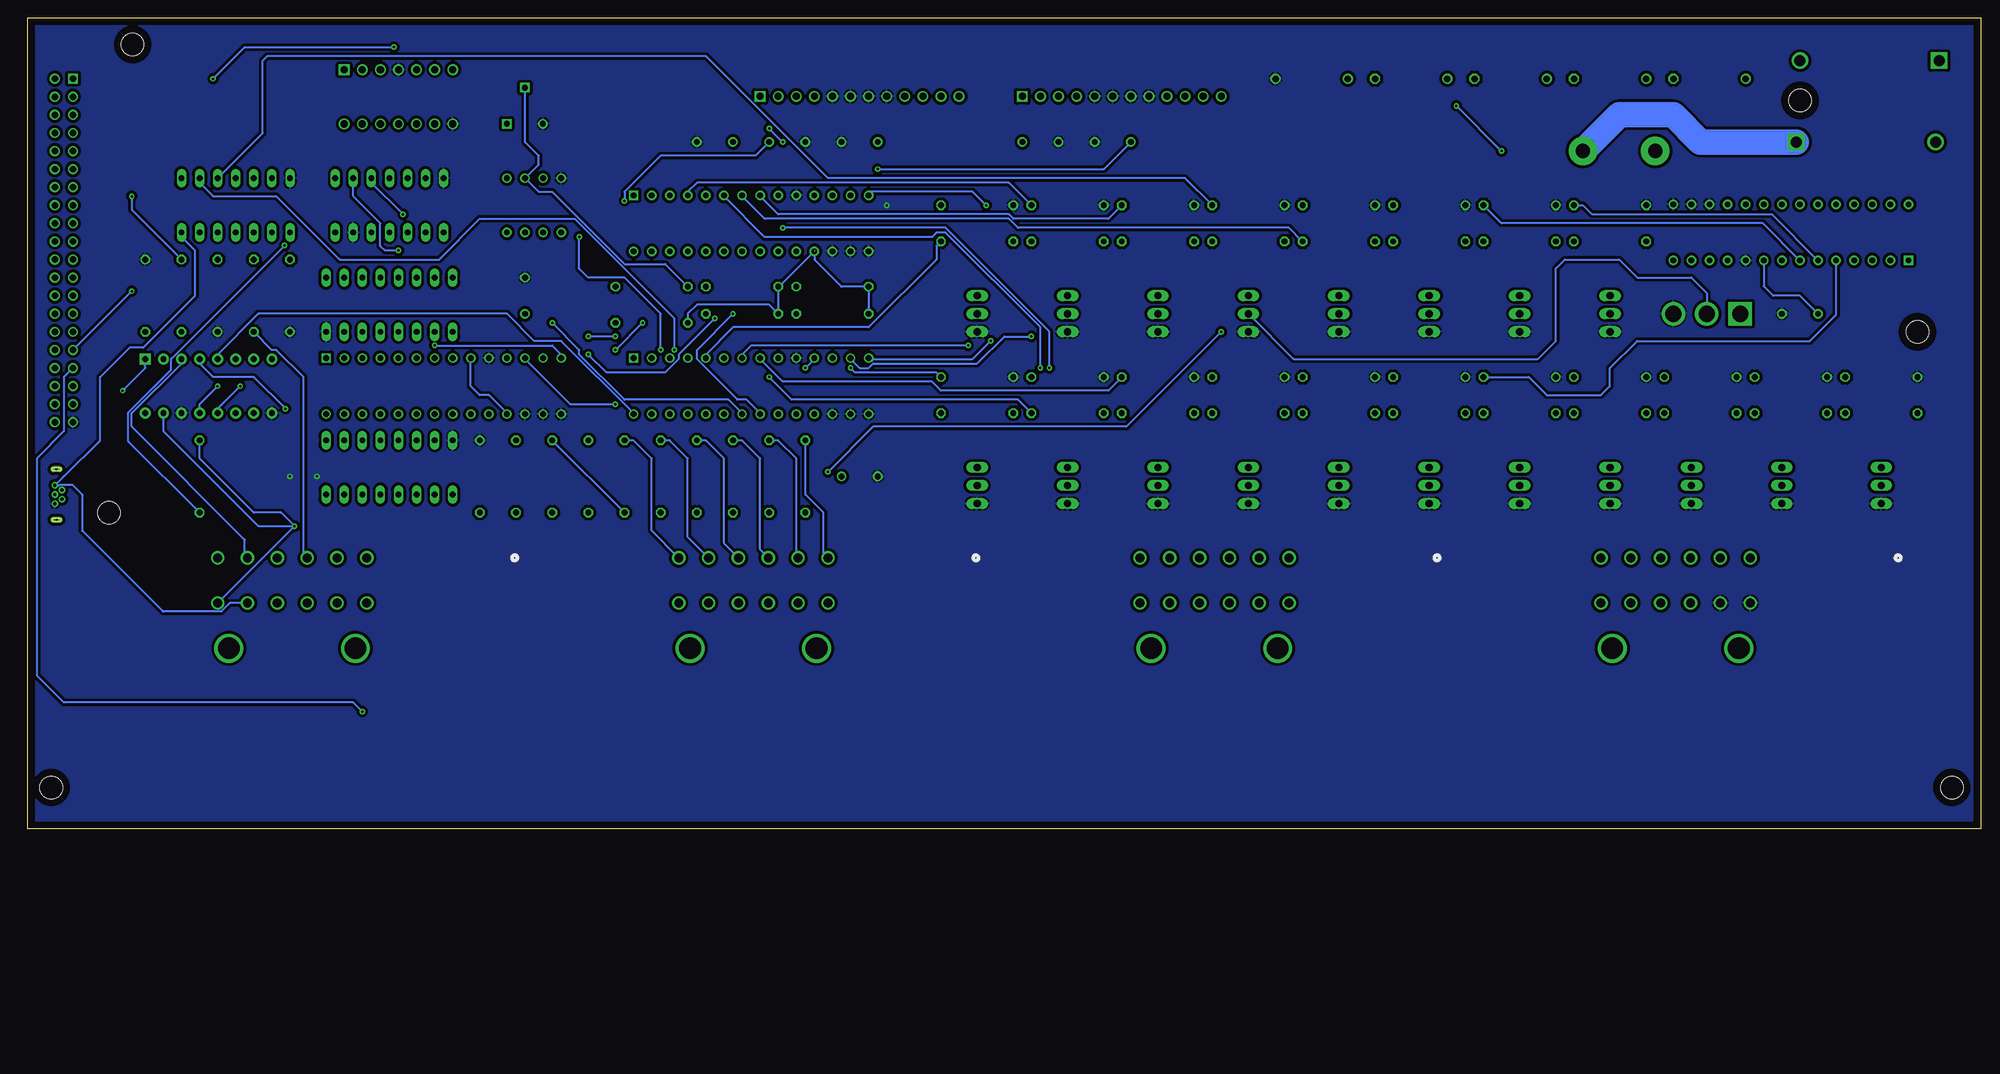
[diagram p5: board, bottom side, seen from below]

Size 274.3 x 113.97 mm. Coordinates in mm from the lower left corner, seen from the top.
Outline: 0,0 274.3,0 274.3,113.97 0,113.97 0,0
Copper layers (1*16): Top 0.035mm / dielectric 1.5mm / Bottom 0.035mm
Design rules "default": minimum track width 6mil, minimum drill 0.35mm, track to track 6mil, track to pad 6mil, pad to pad 6mil, via to via 6mil, smd to smd 6mil, copper to edge 40mil, drill to drill 6mil, minimum pad ring 10mil, minimum via ring 8mil, stop-mask expansion 4mil, vias tented up to drill 0mil, thermal gap 10mil
Holes 3.2 mm at 4.06,5.84 259.59,110.24 271.02,5.84 25.4,102.36 8.89,69.85 262.89,44.45

### Footprints (pad centres in the part's own frame; a part is rotated, then mirrored left to right if it is on the bottom)
TAP5-80 = drill 0.813: + -2.54,0 | drill 0.813 octagon: - 2.54,0
CONV_R-743.3P = drill 1 square: 1 -13.97,3.75 | drill 1: 2 -11.43,3.75; 3 -8.89,3.75; 4 -6.35,3.75; 5 -3.81,3.75; 6 -1.27,3.75; 7 1.27,3.75; 8 3.81,3.75; 9 6.35,3.75; 10 8.89,3.75; 11 11.43,3.75; 12 13.97,3.75
CONV_R-745.0P = drill 1 square: 1 -13.97,3.75 | drill 1: 2 -11.43,3.75; 3 -8.89,3.75; 4 -6.35,3.75; 5 -3.81,3.75; 6 -1.27,3.75; 7 1.27,3.75; 8 3.81,3.75; 9 6.35,3.75; 10 8.89,3.75; 11 11.43,3.75; 12 13.97,3.75
PDIP16_300MC = drill 0.813 pad 1.524 square: 1 -7.62,17.78 | drill 0.813 pad 1.524: 2 -7.62,15.24; 3 -7.62,12.7; 4 -7.62,10.16; 5 -7.62,7.62; 6 -7.62,5.08; 7 -7.62,2.54; 8 -7.62,0; 9 0,0; 10 0,2.54; 11 0,5.08; 12 0,7.62; 13 0,10.16; 14 0,12.7; 15 0,15.24; 16 0,17.78
0207/10 = drill 0.813 octagon: 1 -5.08,0; 2 5.08,0
TO220BV = drill 1.016 long: D 0,-2.54; G -2.54,-2.54; S 2.54,-2.54
B45181D = drill 0.914: + -5.08,0 | drill 0.914 octagon: - 5.08,0
R-6 = drill 1.549 pad 2.057 square: 1 -19.558,0 | drill 1.549 pad 2.057: 2 0,0
DIL16 = drill 0.813 long: 1 -8.89,-3.81; 2 -6.35,-3.81; 3 -3.81,-3.81; 4 -1.27,-3.81; 5 1.27,-3.81; 6 3.81,-3.81; 7 6.35,-3.81; 8 8.89,-3.81; 9 8.89,3.81; 10 6.35,3.81; 11 3.81,3.81; 12 1.27,3.81; 13 -1.27,3.81; 14 -3.81,3.81; 15 -6.35,3.81; 16 -8.89,3.81
DIP254P762X432-14 = drill 0.991 square: 1 -7.62,15.24 | drill 0.991: 2 -7.62,12.7; 3 -7.62,10.16; 4 -7.62,7.62; 5 -7.62,5.08; 6 -7.62,2.54; 7 -7.62,0; 8 0,0; 9 0,2.54; 10 0,5.08; 11 0,7.62; 12 0,10.16; 13 0,12.7; 14 0,15.24
GPIO_XPDR = drill 0.813 square: 1 -3.935,16.51 | drill 0.813: 2 -3.935,13.97; 3 -3.935,11.43; 4 -3.935,8.89; 5 -3.935,6.35; 6 -3.935,3.81; 7 -3.935,1.27; 8 -3.935,-1.27; 9 -3.935,-3.81; 10 -3.935,-6.35; 11 -3.935,-8.89; 12 -3.935,-11.43; 13 -3.935,-13.97; 14 -3.935,-16.51; 15 3.935,-16.51; 16 3.935,-13.97; 17 3.935,-11.43; 18 3.935,-8.89; 19 3.935,-6.35; 20 3.935,-3.81; 21 3.935,-1.27; 22 3.935,1.27; 23 3.935,3.81; 24 3.935,6.35; 25 3.935,8.89; 26 3.935,11.43; 27 3.935,13.97; 28 3.935,16.51
1101M2S3CQE2 = drill 2.286 pad 2.794 square: 1 0,9.398 | drill 2.286 pad 2.794: 2 0,4.699; 3 0,0
DIL14 = drill 0.813 long: 1 -7.62,-3.81; 2 -5.08,-3.81; 3 -2.54,-3.81; 4 0,-3.81; 5 2.54,-3.81; 6 5.08,-3.81; 7 7.62,-3.81; 8 7.62,3.81; 9 5.08,3.81; 10 2.54,3.81; 11 0,3.81; 12 -2.54,3.81; 13 -5.08,3.81; 14 -7.62,3.81
DIL08 = drill 0.813 pad 1.27: 1 -3.81,-3.81; 2 -1.27,-3.81; 3 1.27,-3.81; 4 3.81,-3.81; 5 3.81,3.81; 6 1.27,3.81; 7 -1.27,3.81; 8 -3.81,3.81
POT_3386F = drill 0.813 pad 1.321: 1 -5.055,-5.055 | drill 0.813 pad 1.321 square: 2 -2.515,0.025; 3 0.025,-5.055
TO-247-2V = drill 2 pad 4: 1 -5.08,0; 2 5.08,0
CONN12_DTM13-12PA = drill 1.245 pad 1.753: 1 20.955,-6.35; 2 16.764,-6.35; 3 12.573,-6.35; 4 8.382,-6.35; 5 4.191,-6.35; 6 0,-6.35; 7 0,0; 8 4.191,0; 9 8.382,0; 10 12.573,0; 11 16.764,0; 12 20.955,0 | drill 3.048 pad 3.048: 13 19.355,6.35; 14 1.575,6.35
WURTH_614105150721 = drill 0.44: 1 -1.3,0; 2 -0.65,-1; 3 0,0; 4 0.65,-1; 5 1.3,0 | drill 0.35 long: SH1 -3.575,-0.22; SH2 3.575,-0.22
CON40_P100X100-RIBBON = drill 0.889 pad 1.397 square: 1 -2.54,48.26 | drill 0.889 pad 1.397: 2 -2.54,45.72; 3 -2.54,43.18; 4 -2.54,40.64; 5 -2.54,38.1; 6 -2.54,35.56; 7 -2.54,33.02; 8 -2.54,30.48; 9 -2.54,27.94; 10 -2.54,25.4; 11 -2.54,22.86; 12 -2.54,20.32; 13 -2.54,17.78; 14 -2.54,15.24; 15 -2.54,12.7; 16 -2.54,10.16; 17 -2.54,7.62; 18 -2.54,5.08; 19 -2.54,2.54; 20 -2.54,0; 21 0,0; 22 0,2.54; 23 0,5.08; 24 0,7.62; 25 0,10.16; 26 0,12.7; 27 0,15.24; 28 0,17.78; 29 0,20.32; 30 0,22.86; 31 0,25.4; 32 0,27.94; 33 0,30.48; 34 0,33.02; 35 0,35.56; 36 0,38.1; 37 0,40.64; 38 0,43.18; 39 0,45.72; 40 0,48.26

### Placement (x,y rotation side)
12/3C1  132.08,96.52 180 top
12/3C2  121.92,96.52 0 top
12/5C1  167.64,96.52 180 top
12/5C2  157.48,96.52 0 top
12_TO_3.3  120.65,106.68 180 top
12_TO_5  157.48,106.68 180 top
ADC  240.03,58.42 270 top
ADC1  200.66,49.53 270 top
BAT1  247.65,74.93 90 top
BAT2  252.73,74.93 270 top
BRAKE_MOS  118.11,48.26 270 top
BRK1  115.57,58.42 180 top
BRK2  115.57,63.5 180 top
C1  38.1,105.41 0 top
C2  52.07,105.41 0 top
C3  66.04,105.41 0 top
C4  80.01,105.41 0 top
C5  93.98,105.41 0 top
CLUTCH_MOS  105.41,48.26 270 top
CR1  6.35,96.52 180 top
CR2  25.4,107.95 0 top
CTH1  102.87,58.42 180 top
CTH2  102.87,63.5 180 top
DIFF  223.52,50.8 180 top
DIFF1  205.74,49.53 90 top
DIFF2  210.82,49.53 90 top
DIG11  13.97,58.42 180 top
DIG12  13.97,63.5 180 top
DIG21  26.67,58.42 180 top
DIG22  26.67,63.5 180 top
DIG31  39.37,58.42 180 top
DIG32  39.37,63.5 180 top
DIG41  52.07,58.42 180 top
DIG42  52.07,63.5 180 top
DIG51  64.77,58.42 180 top
DIG52  64.77,63.5 180 top
DIG61  52.07,82.55 180 top
DIG62  52.07,87.63 180 top
DIG71  64.77,82.55 180 top
DIG72  64.77,87.63 180 top
DIG_IN1_MOS  16.51,48.26 270 top
DIG_IN2_MOS  30.48,48.26 270 top
DIG_IN3_MOS  43.18,48.26 270 top
DIG_IN4_MOS  54.61,48.26 270 top
DIG_IN5_MOS  67.31,48.26 270 top
DIG_IN6_MOS  54.61,72.39 270 top
DIG_IN7_MOS  67.31,72.39 270 top
DIGITAL_POT  214.63,99.06 270 top
FAN1  77.47,82.55 180 top
FAN2  77.47,87.63 180 top
FAN_MOS  80.01,72.39 270 top
G1  157.48,49.53 180 top
G1A0  165.1,49.53 90 top
G1A1  170.18,49.53 90 top
G1A2  175.26,49.53 90 top
G1A3  180.34,49.53 90 top
G1A6  185.42,49.53 90 top
G1A7  190.5,49.53 90 top
G2  204.47,74.93 90 top
G3  25.4,72.39 0 top
G4  177.8,96.52 0 top
G4A0  161.29,76.2 0 top
G4A1  161.29,72.39 0 top
G4A2  173.99,76.2 0 top
G4A3  173.99,72.39 0 top
G4A4  186.69,71.12 0 top
GPIO1  172.72,62.23 270 top
GPIO2  215.9,62.23 270 top
GPIO3  26.67,83.82 90 top
GPIO4  172.72,85.09 270 top
GSL1  195.58,49.53 270 top
GSL2  257.81,74.93 90 top
INT1  102.87,82.55 180 top
INT2  102.87,87.63 180 top
INT_MOS  105.41,72.39 270 top
INT_SW  43.18,72.39 90 top
INTERLOCK  223.52,87.63 180 top
INTERLOCK_OR  245.11,87.63 180 top
LA+1  140.97,58.42 180 top
LA+2  140.97,63.5 180 top
LA+_MOS  143.51,48.26 270 top
LA-1  140.97,82.55 180 top
LA-2  140.97,87.63 180 top
LA-_MOS  143.51,72.39 270 top
LHL1  77.47,58.42 180 top
LHL2  77.47,63.5 180 top
LHL_MOS  80.01,48.26 270 top
LTL1  115.57,82.55 180 top
LTL2  115.57,87.63 180 top
LTL_MOS  118.11,72.39 270 top
NEU  250.19,49.53 270 top
OP_AMP  203.2,87.63 180 top
OPAMP1  207.01,104.14 0 top
OPAMP2  186.69,76.2 0 top
PUMP1  128.27,58.42 180 top
PUMP2  128.27,63.5 180 top
PUMP_MOS  130.81,48.26 270 top
R1  50.8,95.25 0 top
RELAY1  53.34,31.75 180 top
RELAY2  118.11,31.75 180 top
RHL1  90.17,58.42 180 top
RHL2  90.17,63.5 180 top
RHL_MOS  92.71,48.26 270 top
RPI_PWR  270.51,46.99 270 top
RPI_SPI  270.51,57.15 0 top
RTL1  90.17,82.55 180 top
RTL2  90.17,87.63 180 top
RTL_MOS  92.71,72.39 270 top
RUN1  128.27,82.55 180 top
RUN2  128.27,87.63 180 top
RUNL_MOS  130.81,72.39 270 top
SIG1  182.88,31.75 180 top
SIG2/PWR  247.65,31.75 180 top
TACH  223.52,73.66 0 top
TACH1  242.57,74.93 90 top
TACH2  237.49,74.93 270 top

### Tracks (layer width: path | path; a pad name or v marks a point on that pad's centre or on a via)
5V
  Top 0.152: 12_TO_5.10 148.64,102.92 148.64,102.93
  Top 0.254: INTERLOCK.14 234.95,83.82 236.86,85.72 250.83,85.72 INTERLOCK_OR.14 | 12/5C2.+ 152.4,96.52 151.77,95.88 151.77,80.01 150.5,78.74 150.5,67.31 151.77,66.04 151.77,57.15 150.5,55.88 150.5,39.37 161.29,28.57 241.55,28.57 243.46,30.48 SIG2/PWR.8
  Top 1.016: 12/5C2.+ 153.67,97.79 153.67,100.39 12_TO_5.9 148.64,102.93 12_TO_5.10 12_TO_5.11
  Bottom 0.254: INTERLOCK_OR.14 252.73,83.19 250.83,81.28 250.83,74.93 258.13,67.63 260.03,67.63 264.16,63.5 264.16,54.61 269.24,49.53 269.27,49.53 RPI_PWR.1 269.93,48.29 269.82,48.39 268.1,48.39 266.7,46.99 266.7,41.91 255.33,30.54 247.15,30.54 246.16,31.53 245.94,31.75 SIG2/PWR.8
12V  (via drill 0.35)
  Top 0.254: BAT2.1 BAT1.2 | v259.71,88.9 243.21,105.41 229.24,105.41 228.6,106.05 228.6,107.31 224.16,111.76 5.08,111.76 2.54,109.22 2.54,100.33 CR1.2
  Top 3.607: RELAY1.9 RELAY1.10 40.66,31.75 37.77,34.64 13.62,34.64 4.23,44.03 4.23,94.4 CR1.2
  Bottom 0.254: BAT2.1 259.71,87 v259.71,88.9
12V_PROTECTED  (via drill 0.35)
  Top 0.152: 12_TO_5.2 168.45,102.72 166.83,102.72 12_TO_5.3
  Top 0.254: OP_AMP.8 204.47,81.28 196.22,81.28 190.5,87 v190.5,88.27
  Top 1.016: 12/3C1.+ 134.62,100.39 12_TO_3.3.2 12_TO_3.3.3 12_TO_3.3.4 124.52,105.41 106.68,105.41 99.06,97.79 60.96,97.79 58.42,95.25 R1.2 60.96,100.33 99.06,100.33 106.68,107.95 124.46,107.95 126.8,105.61 160.61,105.61 163.29,102.93 12_TO_5.4 12_TO_5.3 | 12/5C1.+ 168.91,97.79 12_TO_5.2
  Top 3.556: CR1.1 17.27,96.52 CR2.1
  Bottom 0.254: v190.5,88.27 190.5,89.53 185.42,94.61 172.09,94.61 12/5C1.+
  Bottom 3.556: CR1.1 39.37,96.52 43.18,100.33 50.8,100.33 R1.2
ADC_BAT
  Top 0.254: BAT2.2 249.56,69.85 245.75,66.04 ADC.6
ADC_CS
  Top 0.254: RPI_SPI.15 259.08,60.96 259.08,57.78 257.81,56.52 244.47,56.52 ADC.10
AIR_TEMP  (via drill 0.35)
  Top 0.254: v238.12,59.05 238.12,57.58 239.27,56.44 SIG2/PWR.4
  Bottom 0.254: ADC.4 250.19,65.41 248.28,63.5 242.57,63.5 v238.12,59.05
BRAKE1  (via drill 0.35)
  Top 0.254: G1A0.2 166.37,55.88 169.03,55.88 GPIO1.21 | INTERLOCK.1 224.79,97.79 219.08,97.79 218.44,98.42 218.44,99.69 217.81,100.33 196.22,100.33 185.42,89.53 185.42,88.9 179.07,82.55 176.53,82.55 175.26,81.28 v175.26,72.39
  Bottom 0.254: SIG1.1 162.56,38.73 162.56,44.45 165.1,46.99 G1A0.2 | v175.26,72.39 180.34,67.31 180.34,66.04 174.62,60.33 173.36,60.33 171.45,58.42 GPIO1.21
BRAKE2  (via drill 0.35)
  Top 0.254: G1A1.2 173.87,58.29 GPIO1.22 | v222.25,81.28 210.82,81.28 v200.66,71.12
  Bottom 0.254: SIG1.2 166.37,38.35 166.37,52.07 168.91,54.61 G1A1.2 | INTERLOCK.2 228.6,88.9 224.79,85.09 224.79,81.91 224.16,81.28 v222.25,81.28 | v200.66,71.12 196.85,67.31 196.85,66.67 190.5,60.33 175.9,60.33 173.99,58.42 GPIO1.22
BRAKE_RELAY
  Top 0.254: BRAKE_MOS.D 115.57,47.95 117.37,46.15 117.37,45.29 116.76,44.68 116.31,44.68 RELAY2.4
BRAKE_SIG
  Top 0.254: BRK2.1 BRK1.1
  Bottom 0.254: BRK2.1 122.56,61.59 146.05,61.59 147.32,62.86 168.28,62.86 171.45,66.04 GPIO1.8
CLK  (via drill 0.35)
  Top 0.254: v191.77,59.69 191.77,66.04 189.23,68.58 163.19,68.58 161.29,66.67 GPIO1.12 | ADC.13 251.46,59.69 254,59.69 259.08,64.77 259.08,68.58 RPI_SPI.12 266.7,78.74 266.7,80.64 267.33,81.28 268.61,81.28 269.24,81.91 269.24,83.19 268.61,83.82 263.52,83.82 242.57,104.78 229.24,104.78 DIGITAL_POT.2 222.88,111.12 170.18,111.12 | GPIO3.12 38.1,81.28 48.26,91.44 63.5,91.44 v67.31,95.25 | v73.66,101.6 74.93,102.87 93.34,102.87 101.6,111.12 170.18,111.12 | v168.28,96.52 161.29,89.53 GPIO4.12 | 170.18,111.12 v170.18,98.42 | v247.65,62.23 246.38,60.96 222.88,60.96 219.08,64.77 207.01,64.77 205.74,66.04 204.47,66.04 GPIO2.12
  Bottom 0.254: v191.77,59.69 198.12,59.69 204.47,66.04 GPIO2.12 | v73.66,101.6 v67.31,95.25 | v170.18,98.42 v168.28,96.52 | v247.65,62.23 250.19,59.69 ADC.13
CLUTCH_RELAY
  Top 0.254: CLUTCH_MOS.D 105.54,45.59 RELAY2.3
CLUTCH_SIG  (via drill 0.35)
  Top 0.254: CTH1.1 CTH2.1 110.49,66.04 137.8,66.04 139.7,67.94 v142.24,67.94
  Bottom 0.254: v142.24,67.94 172.72,67.94 173.99,66.67 GPIO1.7
COUNTER1[0]
  Top 0.254: TACH.9 233.68,76.2 233.68,67.44 GPIO2.1
COUNTER1[1]
  Top 0.254: GPIO2.2 TACH.7
COUNTER1[2]
  Top 0.254: TACH.6 GPIO2.3
COUNTER1[3]
  Top 0.254: TACH.5 GPIO2.4
COUNTER1[4]
  Top 0.254: TACH.3 222.25,67.31 GPIO2.5
COUNTER1[5]
  Top 0.254: TACH.2 219.71,67.31 GPIO2.6
COUNTER1[6]
  Top 0.254: GPIO2.7 215.9,67.44 215.9,71.12 217.17,72.39 220.98,72.39 222.25,71.12 TACH.4
COUNTER1[7]
  Top 0.254: GPIO2.8 213.36,67.44 213.36,72.39 215.9,74.93 219.71,74.93 TACH.13
COUNTER1_RS
  Top 0.254: GPIO4.27 186.69,81.21 188.03,82.55 191.77,82.55 194.31,80.01 208.28,80.01 210.37,82.09 222.71,82.09 TACH.11
COUNTER2[0]
  Top 0.254: GPIO2.21 214.63,56.6 215.57,55.66 215.57,52.29 214.63,51.35 DIFF.9
COUNTER2[1]
  Top 0.254: GPIO2.22 DIFF.7
COUNTER2[2]
  Top 0.254: GPIO2.23 DIFF.6
COUNTER2[3]
  Top 0.254: GPIO2.24 DIFF.5
COUNTER2[4]
  Top 0.254: DIFF.3 224.79,57.15 GPIO2.25
COUNTER2[5]
  Top 0.254: DIFF.2 227.33,57.15 GPIO2.26
COUNTER2[6]
  Top 0.254: GPIO2.27 231.14,57.02 231.14,52.07 229.87,50.8 226.06,50.8 224.79,52.07 DIFF.4
COUNTER2[7]
  Top 0.254: DIFF.13 226.92,49.12 230.73,49.12 233.68,52.07 233.68,55.33 232.41,56.6 GPIO2.28
COUNTER2_RS
  Top 0.254: DIFF.11 218.44,48.26 218.44,62.23 217.17,63.5 195.58,63.5 194.31,64.77 194.31,78.74 191.9,81.16 GPIO4.28
DIFF_LOCK
  Top 0.254: GPIO1.24 180.34,57.02 G1A3.2
  Bottom 0.254: SIG1.4 176.53,40.13 176.53,52.07 179.07,54.61 G1A3.2
DIFF_SPEED
  Top 0.254: DIFF1.1 212.09,38.1 SIG2/PWR.1
DIG_IN1
  Top 0.254: RELAY1.1 24.13,38.1 DIG_IN1_MOS.D
DIG_IN1_SIG
  Top 0.254: DIG11.1 DIG12.1 19.05,68.45 10.16,77.34 GPIO3.1
DIG_IN2
  Top 0.254: DIG_IN2_MOS.D 36.58,39.62 RELAY1.2
DIG_IN2_SIG
  Top 0.254: DIG21.1 DIG22.1 25.28,63.5 12.7,76.08 GPIO3.2
DIG_IN3
  Top 0.254: DIG_IN3_MOS.D 41.91,48.26 44.45,45.72 44.45,41.78 RELAY1.3
DIG_IN3_SIG
  Top 0.254: DIG31.1 DIG32.1 44.45,64.77 43.18,66.04 24.01,66.04 15.24,74.8 GPIO3.3
DIG_IN4
  Top 0.254: RELAY1.4 50.27,43.41 50.27,46.15 52.07,47.95 DIG_IN4_MOS.D
DIG_IN4_SIG
  Top 0.254: DIG41.1 DIG42.1 48.32,63.5 47.38,64.44 47.32,64.44 44.45,67.31 24.01,67.31 17.78,73.53 GPIO3.4
DIG_IN5
  Top 0.254: RELAY1.5 53.85,42.8 59.31,42.8 DIG_IN5_MOS.D
DIG_IN5_SIG
  Top 0.254: DIG52.1 DIG51.1
  Bottom 0.254: GPIO3.5 20.32,72.27 24.01,68.58 48.26,68.58 52.07,64.77 52.07,62.23 53.34,60.96 60.96,60.96 63.5,63.5 DIG52.1
DIG_IN6
  Top 0.254: DIG_IN6_MOS.D 53.34,72.39 66.57,59.16 66.57,41.17 64.77,39.37 54.61,39.37 RELAY1.6
DIG_IN6_SIG
  Top 0.254: DIG62.1 DIG61.1
  Bottom 0.254: DIG62.1 55.88,87.63 54.61,86.36 29.34,86.36 GPIO3.6
DIG_IN7
  Top 0.254: DIG_IN7_MOS.D 67.31,69.85 67.31,40.64 64.77,38.1 59.69,38.1 RELAY1.7
DIG_IN7_SIG
  Top 0.254: DIG72.1 DIG71.1
  Bottom 0.254: GPIO3.7 30.61,85.09 67.31,85.09 DIG72.1
ENGINE_FREQ
  Bottom 0.254: TACH1.1 240.03,67.31 239.4,67.31 235.59,63.5 235.59,38.1 SIG2/PWR.3
EXHAUST_TEMP  (via drill 0.35)
  Top 0.254: ADC1.2 213.36,31.75 SIG2/PWR.12 229.24,34.29 242.57,34.29 245.11,36.83 250.19,36.83 260.99,47.62 v260.99,61.59
  Bottom 0.254: ADC.1 257.81,64.77 v260.99,61.59
FAN_RELAY
  Top 0.254: FAN_MOS.D 80.01,74.93 80.01,93.98 81.28,95.25 144.78,95.25 151.13,88.9 151.13,80.01 149.86,78.74 149.86,67.31 151.13,66.04 151.13,57.15 149.86,55.88 149.86,43.18 124.46,17.78 113.03,17.78 99.06,31.75 RELAY2.12
FAN_SIG  (via drill 0.35)
  Top 0.254: FAN2.1 FAN1.1 82.55,77.47 88.9,71.12 104.14,71.12 105.41,69.85 v106.68,69.85 | v161.93,50.16 167.64,50.16 175.26,57.78 175.26,58.42 177.16,60.33 182.25,60.33 187.96,66.04 189.23,66.04 GPIO1.1
  Bottom 0.254: v161.93,50.16 155.58,56.52 120.02,56.52 v106.68,69.85
GND  (via drill 0.35)
  Top 0.254: v233.68,49.53 v237.49,49.53 | GPIO1.10 166.37,62.23 162.44,58.29 GPIO1.17 | GPIO4.15 153.67,83.69 v153.67,87.63 153.67,93.98 155.27,95.58 157.87,95.58 158.81,96.52 12/5C2.-
  Top 0.483: TACH2.2 237.49,73.66 238.76,74.93 243.84,74.93 247.65,71.12 BAT1.1
  pour Bottom (isolate 0.406): 0,114.3 0,0 274.32,0 274.32,114.3
GPIO1_CS  (via drill 0.35)
  Top 0.254: v165.1,64.77 165.1,63.5 160.02,58.42 160.02,51.43 158.75,50.16 158.75,47.62 170.18,36.2 172.09,36.2 177.8,30.48 240.03,30.48 245.11,35.56 250.12,35.56 261.75,47.19 264.36,47.19 273.05,55.88 273.05,60.96 271.78,62.23 RPI_SPI.23
  Bottom 0.254: v165.1,64.77 163.83,66.04 GPIO1.11
GPIO2_CS  (via drill 0.35)
  Top 0.254: GPIO2.11 207.01,67.94 203.2,71.75 203.2,73.03 209.55,79.38 222.88,79.38 223.52,78.74 223.52,76.2 224.16,75.56 227.97,75.56 228.6,76.2 228.6,78.74 231.14,81.28 254,81.28 v259.71,75.56
  Bottom 0.254: RPI_SPI.16 v259.71,75.56
GPIO3_CS  (via drill 0.35)
  Top 0.254: GPIO3.11 35.56,79.38 36.83,79.38 41.27,74.93 44.45,74.93 54.61,64.77 57.78,64.77 58.42,64.13 58.42,49.53 46.99,38.1 46.99,35.56 48.26,34.29 49.53,34.29 50.8,33.02 50.8,30.48 52.07,29.21 55.88,29.21 68.58,16.51 v227.33,16.51
  Bottom 0.254: v227.33,16.51 228.6,17.78 269.24,17.78 273.05,21.59 273.05,52.07 269.24,55.88 269.24,63.5 RPI_SPI.17
GPIO4_CS  (via drill 0.35)
  Top 0.254: v222.88,109.85 185.42,109.85 165.1,89.53 163.83,89.53 GPIO4.11 | v248.28,105.41 267.33,86.36 271.14,86.36 271.78,85.72 271.78,68.58 RPI_SPI.25
  Bottom 0.254: v222.88,109.85 243.84,109.85 v248.28,105.41
GSL
  Top 0.254: SIG1.7 GSL1.2
HAZARD
  Top 0.254: GPIO4.23 176.53,78.74 G4A2.2 179.01,76.2 176.86,74.05 176.86,71.12 154.94,71.12 153.67,69.85 153.67,67.31 154.94,66.04 154.94,57.15 153.67,55.88 153.67,39.37 158.75,34.29 167.77,34.29 SIG1.10
INTERLOCK_OVERRIDE  (via drill 0.35)
  Top 0.254: v183.52,67.31 182.88,66.67 182.88,66.04 181.61,64.77 179.07,64.77 177.8,66.04 176.53,66.04 GPIO1.6
  Bottom 0.254: v183.52,67.31 183.52,71.75 197.49,85.72 210.82,85.72 216.53,80.01 230.5,80.01 239.4,88.9 248.28,88.9 250.19,90.8 INTERLOCK_OR.2
INTERLOCK_RELAY
  Top 0.254: INT_MOS.D 105.41,74.93 105.41,91.44 106.68,92.71 144.78,92.71 148.59,88.9 148.59,80.01 147.32,78.74 147.32,67.31 148.59,66.04 148.59,57.15 147.32,55.88 147.32,43.18 124.46,20.32 113.03,20.32 105.54,27.81 RELAY2.10
  Bottom 0.254: INT_MOS.D 96.52,66.04 62.23,66.04 59.69,68.58 59.69,78.74 58.42,80.01 50.8,80.01 48.26,77.47 40.64,77.47 38.48,75.31 INT_SW.2
INTERLOCK_SIG
  Top 0.254: INT2.1 INT1.1
  Bottom 0.254: INT2.1 111.76,91.44 161.93,91.44 179.07,108.58 240.66,108.58 241.3,107.95 241.3,97.79 INTERLOCK_OR.3
L_HEADLIGHT
  Top 0.254: LHL_MOS.D 81.28,48.26 91.44,38.1 RELAY2.1
L_TAILLIGHT
  Top 0.254: RELAY2.9 109.73,26.16 114.3,21.59 124.46,21.59 146.05,43.18 146.05,55.88 147.32,57.15 147.32,66.04 146.05,67.31 146.05,78.74 147.32,80.01 147.32,88.9 144.78,91.44 119.38,91.44 118.11,90.17 118.11,73.66 116.84,72.39 LTL_MOS.D
L_TURN
  Top 0.254: SIG1.11 164.85,33.02 158.75,33.02 152.4,39.37 152.4,55.88 153.67,57.15 153.67,66.04 152.4,67.31 152.4,77.47 153.67,78.74 159.96,78.74 166.34,72.36 G4A1.2 166.37,73.66 167.64,74.93 170.18,74.93 173.99,78.74 GPIO4.22
LA+_RELAY
  Top 0.254: LA+_MOS.D 130.81,38.1 RELAY2.6
LA+_SIG  (via drill 0.35)
  Top 0.254: LA+1.1 LA+2.1 | v158.75,64.77 161.29,64.77 162.56,66.04 162.56,66.67 163.83,67.94 179.07,67.94 180.34,66.67 181.61,66.67 GPIO1.4
  Bottom 0.254: v158.75,64.77 158.12,64.13 146.69,64.13 LA+2.1
LA-_RELAY
  Top 0.254: LA-_MOS.D 142.24,72.39 143.51,71.12 143.51,67.31 142.24,66.04 142.24,55.88 143.51,54.61 143.51,43.18 132.08,31.75 RELAY2.7
LA-_SIG
  Top 0.254: LA-2.1 LA-1.1
  Bottom 0.254: LA-1.1 146.69,81.91 146.69,80.01 156.21,70.48 175.26,70.48 179.07,66.67 GPIO1.5
LHL_SIG  (via drill 0.35)
  Top 0.254: LHL1.1 LHL2.1 83.82,64.77 98.43,64.77 106.05,57.15 108.59,57.15 109.22,57.78 109.22,59.05 114.94,64.77 v130.81,64.77 | v168.28,84.45 173.36,84.45 177.8,88.9 179.07,88.9 GPIO4.5
  Bottom 0.254: v168.28,84.45 145.41,84.45 130.81,69.85 v130.81,64.77
LIGHTS
  Top 0.254: GPIO4.24 180.34,79.88 180.34,73.66 G4A3.2 179.07,71.12 177.8,69.85 158.57,69.85 157.48,68.76 157.48,36.83 158.75,35.56 171.45,35.56 174.5,32.51 SIG1.9
LTL_SIG
  Top 0.254: LTL2.1 LTL1.1
  Bottom 0.254: LTL2.1 122.56,85.72 135.89,85.72 136.53,86.36 168.91,86.36 171.45,88.9 GPIO4.8
MISO  (via drill 0.35)
  Top 0.254: v217.17,67.94 218.44,66.67 218.44,66.04 222.25,62.23 v244.47,62.23 | RPI_SPI.11 269.24,78.74 269.24,71.75 268.61,71.12 266.06,71.12 254,59.05 254,57.78 253.37,57.15 248.92,57.15 ADC.12 | 134.62,67.94 138.43,67.94 v139.06,68.58 | 134.62,67.94 76.84,67.94 71.12,73.66 50.8,73.66 45.09,79.38 43.18,79.38 GPIO3.14 | v139.7,87.63 135.89,83.82 135.25,83.82 134.62,83.19 134.62,67.94 | v195.58,66.67 199.39,66.67 GPIO2.14 | v177.8,71.75 177.8,71.12 177.16,70.48 158.12,70.48 156.21,68.58 GPIO1.14
  Bottom 0.254: v217.17,67.94 200.66,67.94 199.39,66.67 GPIO2.14 | v244.47,62.23 247.65,59.05 ADC.12 | v139.06,68.58 141.61,66.04 156.21,66.04 GPIO1.14 | v139.7,87.63 141.61,89.53 156.21,89.53 GPIO4.14 | v195.58,66.67 193.04,64.13 184.78,64.13 182.88,66.04 182.88,66.67 v177.8,71.75
MOSI  (via drill 0.35)
  Top 0.254: GPIO4.13 158.75,88.9 160.02,88.9 161.29,87.63 166.37,87.63 167.64,88.9 167.64,90.8 182.25,105.41 223.52,105.41 DIGITAL_POT.3 227.33,104.14 242.63,104.14 263.36,83.41 267.11,83.41 RPI_SPI.10 252.73,67.31 249.56,67.31 248.92,66.67 248.92,62.23 ADC.11 243.21,60.33 220.98,60.33 217.17,64.13 203.84,64.13 201.93,66.04 GPIO2.13 201.93,66.67 199.39,69.22 v195.58,69.22 | GPIO1.13 158.75,66.67 160.02,66.67 162.56,69.22 v191.77,69.22 | v133.35,69.22 132.72,68.58 88.9,68.58 86.36,71.12 76.2,71.12 75.56,71.75 75.56,73.66 60.32,88.9 50.8,88.9 41.91,80.01 40.64,80.01 GPIO3.13
  Bottom 0.254: v133.35,69.22 137.16,69.22 140.97,65.41 155.58,65.41 156.21,64.77 157.48,64.77 158.75,66.04 GPIO1.13 | v191.77,69.22 v195.58,69.22
N$1
  Top 0.254: FAN1.2 77.47,77.47 FAN_MOS.G
N$2
  Top 0.254: PUMP1.2 128.27,53.34 PUMP_MOS.G
N$4
  Top 0.254: LA+1.2 140.97,53.34 LA+_MOS.G
N$5
  Top 0.254: LA-1.2 140.97,77.47 LA-_MOS.G
N$6
  Top 0.254: INT1.2 102.87,77.47 INT_MOS.G
N$7
  Top 0.254: DIG61.2 52.07,77.47 DIG_IN6_MOS.G
N$8
  Bottom 0.254: OPAMP2.1 184.78,79.38 190.5,79.38 200.66,89.53 202.56,89.53 OP_AMP.2 202.56,93.34 202.56,94.61 204.47,96.52 204.47,104.14 OPAMP1.2
N$9
  Top 0.254: DIG71.2 64.77,77.47 DIG_IN7_MOS.G
N$10
  Top 0.254: GSL1.1 197.49,54.61 212.72,39.37 236.22,39.37 238.76,36.83 240.03,36.83 241.3,38.1 241.3,59.05 241.94,59.69 243.21,59.69 243.84,59.05 243.84,57.78 244.47,57.15 245.75,57.15 246.38,57.78 246.38,59.05 252.09,64.77 254,64.77 ADC.2 257.81,68.58 GSL2.1
N$11
  Top 0.254: DIG41.2 52.07,53.34 DIG_IN4_MOS.G
N$12
  Top 0.254: DIG51.2 64.77,53.34 DIG_IN5_MOS.G
N$13
  Top 0.254: TACH.10 229.87,78.74 231.14,80.01 TACH2.1 TACH1.2
N$14
  Top 0.254: DIG11.2 13.97,53.34 DIG_IN1_MOS.G
N$15
  Top 0.254: DIG21.2 27.94,52.07 DIG_IN2_MOS.G
N$16
  Top 0.254: DIFF1.2 210.82,49.53 DIFF2.1 211.15,44.12 213.75,44.12 216.62,46.99 DIFF.10
N$17
  Top 0.254: DIG31.2 40.64,52.07 DIG_IN3_MOS.G
N$18
  Top 0.254: LHL1.2 77.47,53.34 LHL_MOS.G
N$19
  Top 0.254: RHL1.2 90.17,53.34 RHL_MOS.G
N$20
  Top 0.254: LTL1.2 115.57,77.47 LTL_MOS.G
N$21
  Top 0.254: RTL1.2 90.17,77.47 RTL_MOS.G
N$22
  Top 3.607: C2.+ C1.-
N$24
  Top 3.556: CR2.2 30.48,107.95 C1.+ 35.56,105.41 R1.1
N$26
  Top 0.254: RUN1.2 128.27,77.47 RUNL_MOS.G
N$31
  Top 3.607: C2.- C3.+
N$32
  Top 0.254: CTH1.2 102.87,53.34 CLUTCH_MOS.G
N$33
  Top 0.254: BRK1.2 115.57,53.34 BRAKE_MOS.G
N$34
  Top 3.607: C3.- C4.+
N$35
  Top 3.607: C4.- C5.+
NEUTRAL  (via drill 0.35)
  Top 0.254: SIG2/PWR.6 247.65,41.91 NEU.2 | INTERLOCK.12 226.57,83.82 228.4,81.99 v238.25,81.99
  Bottom 0.254: v238.25,81.99 254.2,66.04 254.2,64.52 260.2,58.52 260.2,54.46 NEU.2
NOR_OUT
  Top 0.254: INTERLOCK.5 222.88,89.53 250.83,89.53 INTERLOCK_OR.1
OIL_PRESSURE
  Top 0.254: GPIO1.27 186.69,55.88 G1A6.2
  Bottom 0.254: SIG1.5 181.61,41.02 181.61,52.07 184.15,54.61 G1A6.2
OIL_TEMP
  Top 0.254: GPIO1.28 190.5,57.02 G1A7.2
  Bottom 0.254: SIG1.6 186.69,41.91 186.69,52.07 189.23,54.61 G1A7.2 | ADC.5 247.65,66.67 241.94,72.39 207.01,72.39 203.2,68.58 199.39,68.58 189.23,58.42 GPIO1.28
OPAMP_OUT
  Top 0.254: OP_AMP.1 205.74,90.17 188.59,90.17 187.96,89.53 187.96,88.9 185.42,86.36 185.42,80.64 189.87,76.2 OPAMP2.2 193.68,74.3 193.68,60.96 194.31,60.33 194.31,57.78 193.68,57.15 193.68,54.61 211.46,36.83 227.33,36.83 228.6,38.1 SIG2/PWR.2
POT_CS
  Top 0.254: RPI_SPI.18 269.24,63.5 271.14,63.5 272.42,64.77 272.42,105.41 271.14,106.68 DIGITAL_POT.1
POT_OUT
  Top 0.254: OP_AMP.3 208.28,97.79 215.9,97.79 DIGITAL_POT.9
PUMP_RELAY
  Top 0.254: PUMP_MOS.D 124.08,44.07 119.89,44.07 RELAY2.5
PUMP_SIG  (via drill 0.35)
  Top 0.254: PUMP2.1 PUMP1.1 | v170.18,63.5 182.88,63.5 185.42,66.04 186.69,66.04 GPIO1.2
  Bottom 0.254: v170.18,63.5 167,60.33 135.25,60.33 PUMP1.1
R_HEADLIGHT
  Top 0.254: RHL_MOS.D 91.19,48.26 RELAY2.2
R_TAILLIGHT
  Top 0.254: RTL_MOS.D 92.71,74.93 92.71,92.71 93.98,93.98 144.78,93.98 149.86,88.9 149.86,80.01 148.59,78.74 148.59,67.31 149.86,66.04 149.86,57.15 148.59,55.88 148.59,43.18 124.46,19.05 113.03,19.05 101.35,30.73 RELAY2.11
R_TURN
  Top 0.254: GPIO4.21 171.33,81.16 G4A0.2 162.56,80.01 152.4,80.01 151.13,78.74 151.13,67.31 152.4,66.04 152.4,57.15 151.13,55.88 151.13,39.37 158.75,31.75 SIG1.12
RHL_SIG  (via drill 0.35)
  Top 0.254: 95.25,62.86 RHL1.1 | v132.08,64.77 132.08,52.07 129.54,49.53 108.59,49.53 95.25,62.86 | 95.25,62.86 RHL2.1
  Bottom 0.254: v132.08,64.77 132.08,70.48 145.41,83.82 146.69,83.82 147.32,83.19 170.81,83.19 176.53,88.9 GPIO4.6
RTL_SIG
  Top 0.254: RTL2.1 RTL1.1
  Bottom 0.254: RTL1.1 97.16,84.45 135.25,84.45 136.53,85.72 170.81,85.72 173.99,88.9 GPIO4.7
RUN_L
  Top 0.254: RUNL_MOS.D 130.81,74.93 130.81,87.63 133.35,90.17 138.43,90.17 140.97,87.63 140.97,83.82 144.78,80.01 144.78,66.04 143.51,64.77 143.51,57.15 144.78,55.88 144.78,43.18 130.81,29.21 116.46,29.21 RELAY2.8
RUN_LIGHT
  Top 0.254: GPIO4.25 191.65,71.12 G4A4.2 193.04,69.85 193.04,60.96 193.9,60.1 193.9,58.01 193.04,57.15 193.04,43.18 184.15,34.29 181.23,34.29 SIG1.8
RUNL_SIG
  Top 0.254: RUN2.1 RUN1.1
  Bottom 0.254: RUN2.1 136.53,90.8 180.34,90.8 181.61,89.53 GPIO4.4
SEAT  (via drill 0.35)
  Top 0.254: G1A2.2 175.26,57.02 GPIO1.23 176.53,58.42 177.8,59.69 184.78,59.69 190.5,65.41 190.5,66.67 189.87,67.31 v185.42,67.31 | v221.62,86.36 200.03,86.36 v196.85,83.19
  Bottom 0.254: SIG1.3 171.45,39.24 171.45,52.07 173.99,54.61 G1A2.2 | INTERLOCK.3 226.06,90.8 v221.62,86.36 | v196.85,83.19 196.85,78.74 195.58,77.47 190.5,77.47 185.42,72.39 v185.42,67.31
SHOCK_PRESSURE
  Bottom 0.254: ADC.3 252.73,65.41 259.71,58.42 259.71,56.52 243.84,40.64 243.84,38.1 SIG2/PWR.5
VDD  (via drill 0.35)  (1 unrouted)
  Top 0.254: GPIO3.9 35.56,84.97 GPIO3.18 35.56,91.44 36.83,92.71 59.69,92.71 63.5,96.52 12/3C2.+ | GPIO2.9 205.87,72.39 G2.+ 209.55,77.47 TACH.16 | GPIO1.9 168.91,60.96 167.64,59.69 165.1,59.69 163.83,58.42 GPIO1.18 162.56,57.02 162.56,52.07 G1.+ G1A0.1 G1A1.1 G1A2.1 G1A3.1 G1A6.1 G1A7.1 192.41,46.35 192.41,57.15 193.04,57.78 193.04,60.33 192.41,60.96 192.41,66.67 v191.77,67.31 | DIGITAL_POT.14 228.6,100.33 226.06,100.33 DIGITAL_POT.12 DIGITAL_POT.11 DIGITAL_POT.10 217.81,100.97 179.71,100.97 G4.+ 175.26,95.38 GPIO4.9 168.91,86.36 163.83,81.28 | ADC.16 ADC.15 | v236.86,42.54 DIFF.16 228.6,43.18 209.55,43.18 200.66,52.07 ADC1.1 201.93,55.88 204.59,55.88 GPIO2.18 | v187.96,71.12 G4A4.1 | v154.94,92.71 157.48,90.17 157.48,87.57 163.77,81.28 163.83,81.28 | 163.83,81.28 163.8,81.25
  Top 1.016: 12_TO_3.3.11 12_TO_3.3.10 12_TO_3.3.9 114.3,101.6 12/3C2.+
  Bottom 0.254: GPIO3.9 30.48,76.26 29.15,74.93 25.4,74.93 G3.+ | GPIO2.9 212.09,62.23 210.82,60.96 209.55,60.96 207.01,58.42 GPIO2.18 | G4A1.1 G4A0.1 160.02,76.2 163.83,80.01 GPIO4.18 168.78,76.2 G4A2.1 G4A3.1 170.18,73.66 180.34,73.66 181.61,72.39 G4A4.1 | v236.86,42.54 SIG2/PWR.7 | ADC.15 255.27,55.88 241.94,42.54 v236.86,42.54 | ADC1.1 G1A7.1 | 12/3C2.+ 123.19,92.71 v154.94,92.71 | v236.86,42.54 238.76,44.45 242.57,44.45 250.19,52.07 NEU.1 | v187.96,71.12 v191.77,67.31
(copper drawn outside any net)
  shapes: Top area x1

### Text on the board
tPlace: Top | Top | Top | OFF | ON | Top | Top | Top | Katherine Gledson / UofM Association of Tiny Tractors (UMATT) / P20 Control Board V1